# EAGLE design SAB Test Board rev 1 (EAGLE 9.6.2)

## Sheet 1 of 2
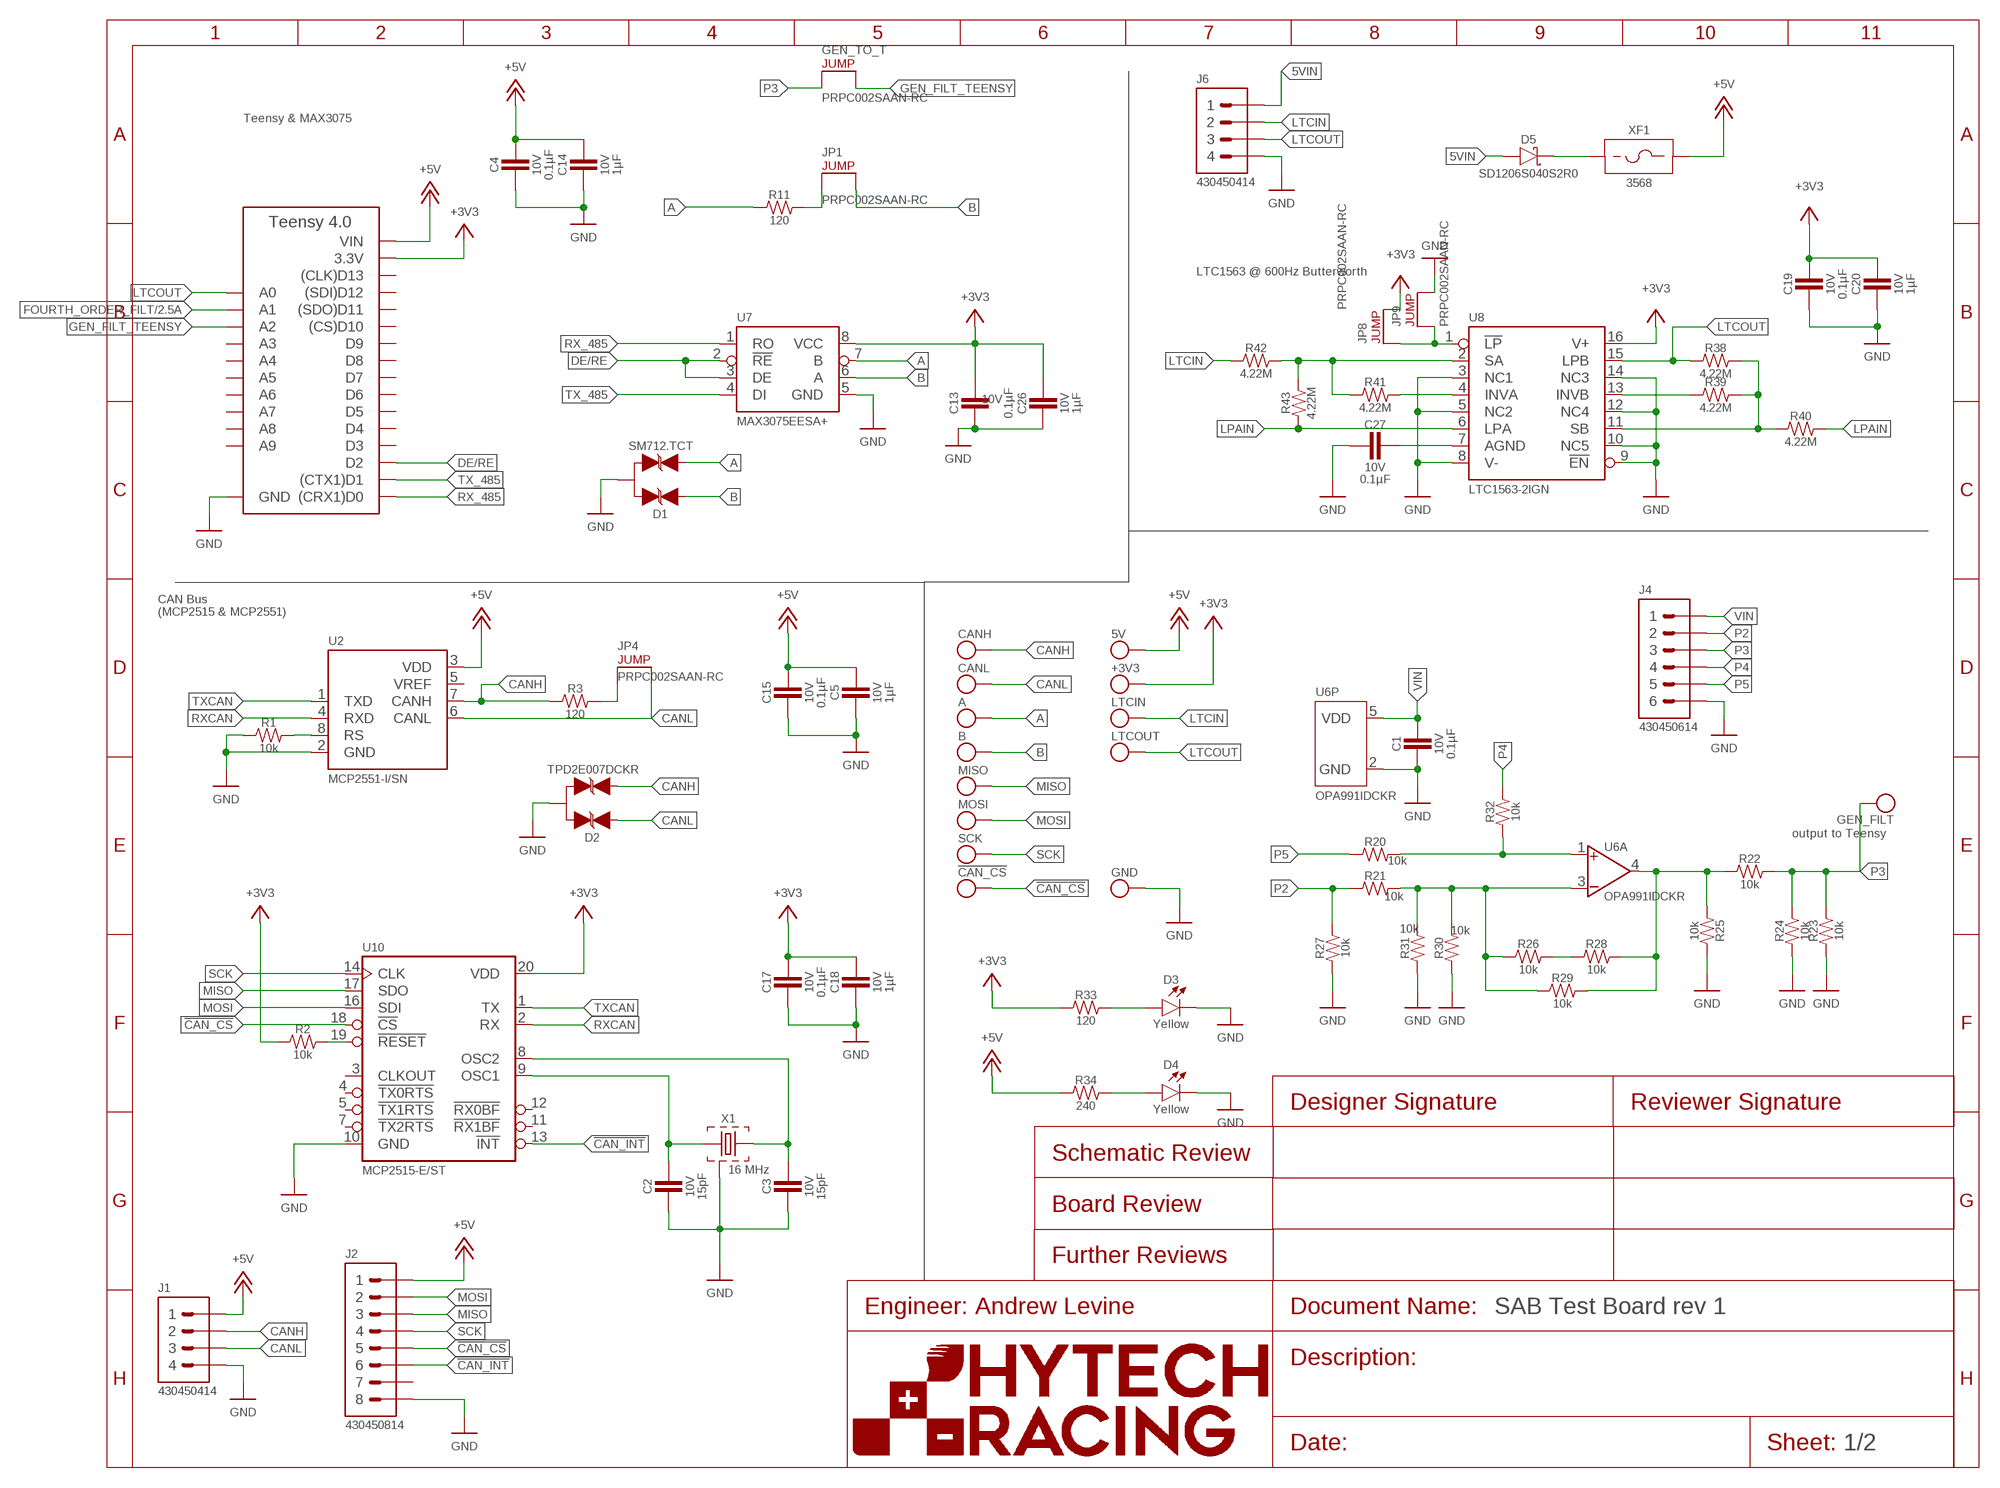
[diagram p0: schematic, sheet 1]

### Parts
5V  TEST_POINT  [5015]
!CAN_CS  TEST_POINT  [5015]
+3V3  TEST_POINT  [5015]
A  TEST_POINT  [5015]
A1  TEENSY_4.0TH  [TEENSY_SHORT]
B  TEST_POINT  [5015]
C1  CAPACITOR_0603_10V_0.1UF  [0603-CAP]
C2  CAPACITOR_0603_10V_15PF  [0603-CAP]
C3  CAPACITOR_0603_10V_15PF  [0603-CAP]
C4  CAPACITOR_0603_10V_0.1UF  [0603-CAP]
C5  CAPACITOR_0603_10V_1UF  [0603-CAP]
C13  CAPACITOR_0603_10V_0.1UF  [0603-CAP]
C14  CAPACITOR_0603_10V_1UF  [0603-CAP]
C15  CAPACITOR_0603_10V_0.1UF  [0603-CAP]
C17  CAPACITOR_0603_10V_0.1UF  [0603-CAP]
C18  CAPACITOR_0603_10V_1UF  [0603-CAP]
C19  CAPACITOR_0603_10V_0.1UF  [0603-CAP]
C20  CAPACITOR_0603_10V_1UF  [0603-CAP]
C26  CAPACITOR_0603_10V_1UF  [0603-CAP]
C27  CAPACITOR_0603_10V_0.1UF  [0603-CAP]
CANH  TEST_POINT  [5015]
CANL  TEST_POINT  [5015]
D1  TVS_BIDIRECTIONAL_DUALRS422  [SOT-23]
D2  TVS_BIDIRECTIONAL_DUAL  [SC-70-3]
D3  LED_0603_YELLOW  [0603-LED]
D4  LED_0603_YELLOW  [0603-LED]
D5  SCHOTTKY_1206_40V  [1206-DIODE]
GEN_FILT  TEST_POINT  [5015]
GEN_TO_T  JUMPER__1X02  [1X02]
GND  TEST_POINT  [5015]
J1  CONNECTOR-4_μF_T_V_BLACK  [MOLEX_MICROFIT_PTH_VERTICAL_04_DUAL]
J2  CONNECTOR-8_μF_T_V_BLACK  [MOLEX_MICROFIT_PTH_VERTICAL_08_DUAL]
J4  CONNECTOR-6_μF_T_V_BLACK  [MOLEX_MICROFIT_PTH_VERTICAL_06_DUAL]
J6  CONNECTOR-4_μF_T_V_BLACK  [MOLEX_MICROFIT_PTH_VERTICAL_04_DUAL]
JP1  JUMPER__1X02  [1X02]
JP4  JUMPER__1X02  [1X02]
JP8  JUMPER__1X02  [1X02]
JP9  JUMPER__1X02  [1X02]
LTCIN  TEST_POINT  [5015]
LTCOUT  TEST_POINT  [5015]
MISO  TEST_POINT  [5015]
MOSI  TEST_POINT  [5015]
R1  RESISTOR_0603_10K  [0603-RES]
R2  RESISTOR_0603_10K  [0603-RES]
R3  RESISTOR_0603_120  [0603-RES]
R11  RESISTOR_0603_120  [0603-RES]
R20  RESISTOR_0603_10K  [0603-RES]
R21  RESISTOR_0603_10K  [0603-RES]
R22  RESISTOR_0603_10K  [0603-RES]
R23  RESISTOR_0603_10K  [0603-RES]
R24  RESISTOR_0603_10K  [0603-RES]
R25  RESISTOR_0603_10K  [0603-RES]
R26  RESISTOR_0603_10K  [0603-RES]
R27  RESISTOR_0603_10K  [0603-RES]
R28  RESISTOR_0603_10K  [0603-RES]
R29  RESISTOR_0603_10K  [0603-RES]
R30  RESISTOR_0603_10K  [0603-RES]
R31  RESISTOR_0603_10K  [0603-RES]
R32  RESISTOR_0603_10K  [0603-RES]
R33  RESISTOR_0603_120  [0603-RES]
R34  RESISTOR_0603_240  [0603-RES]
R38  RESISTOR_0603_4.22M  [0603-RES]
R39  RESISTOR_0603_4.22M  [0603-RES]
R40  RESISTOR_0603_4.22M  [0603-RES]
R41  RESISTOR_0603_4.22M  [0603-RES]
R42  RESISTOR_0603_4.22M  [0603-RES]
R43  RESISTOR_0603_4.22M  [0603-RES]
SCK  TEST_POINT  [5015]
U2  MCP2551  [SOIC-08(NARROW,0.15")]
U6  OPAMP_1_CHANNEL_OPA991  [SC-70-5]
U7  MAX3075  [SOIC-08(NARROW,0.15")]
U8  LTC1563  [SSOP-16]
U10  MCP2515  [TSSOP-20]
X1  CRYSTAL_16MHZ  [ECX-42]
XF1  FUSE_HOLDER_MINIBLADEPTH  [3568]

### Nets
5VIN: D5.1(A) J6.1
!CAN_CS: !CAN_CS.1 J2.5 U10.18(!CS)
!CAN_INT: J2.6 U10.13(!INT)
+3V3: +3V3.1 A1.3.3V C13.1 C17.1 C18.1 C19.1 C20.1 C26.1 JP8.2 R2.1 R33.1 U7.8(VCC) U8.16(V+) U10.20(VDD) ; also sheet 2
+5V: 5V.1 A1.VIN C4.1 C5.1 C14.1 C15.1 J1.1 J2.1 R34.1 U2.3(VDD) XF1.3 XF1.4 ; also sheet 2
A: A.1 D1.2(C2) R11.1 U7.7(B)
B: B.1 D1.1(C1) JP1.2 U7.6(A)
CANH: CANH.1 D2.2(C2) J1.2 R3.1 U2.7(CANH)
CANL: CANL.1 D2.1(C1) J1.3 JP4.2 U2.6(CANL)
DE/RE: A1.D2 U7.2(!RE) U7.3(DE)
FOURTH_ORDER_FILT: A1.D15(A1) ; also sheet 2
GEN_FILT_TEENSY: A1.D16(A2) GEN_TO_T.2
GND: A1.AGND/GND(GND) A1.GND C1.2 C2.2 C3.2 C4.2 C5.2 C13.2 C14.2 C15.2 C17.2 C18.2 C19.2 C20.2 C26.2 C27.2 D1.3(A) D2.3(A) D3.1(C) D4.1(C) GND.1 J1.4 J2.8 J4.6 J6.4 JP9.2 R1.1 R23.1 R24.1 R25.2 R27.1 R30.1 R31.1 U2.2(GND) U6.2(P:GND) U7.5(GND) U8.3(NC1) U8.5(NC2) U8.8(V-) U8.9(!EN) U8.10(NC5) U8.12(NC4) U8.14(NC3) U10.10(GND) X1.2(GND) X1.4(GND) ; also sheet 2
LPAIN: R40.2 R43.1 U8.6(LPA)
LTCIN: J6.2 LTCIN.1 R42.1
LTCOUT: A1.D14(A0) J6.3 LTCOUT.1 R38.1 U8.15(LPB)
MISO: J2.3 MISO.1 U10.17(SDO)
MOSI: J2.2 MOSI.1 U10.16(SDI)
N$1: C2.1 U10.9(OSC1) X1.1
N$2: C3.1 U10.8(OSC2) X1.3
N$3: R1.2 U2.8(RS)
N$4: JP4.1 R3.2
N$5: R2.2 U10.19(!RESET)
N$6: D5.2(C) XF1.1 XF1.2
N$7: JP1.1 R11.2
N$9: R22.1 R25.1 R28.2 R29.2 U6.4(A:VOUT)
N$10: JP8.1 JP9.1 U8.1(!LP)
N$12: R20.2 R32.1 U6.1(A:VIN+)
N$23: D3.2(A) R33.2
N$25: D4.2(A) R34.2
N$27: R26.2 R28.1
N$28: R21.2 R26.1 R29.1 R30.2 R31.2 U6.3(A:VIN-)
N$29: C27.1 U8.7(AGND)
N$32: R39.1 U8.13(INVB)
N$33: R38.2 R39.2 R40.1 U8.11(SB)
N$34: R41.2 U8.4(INVA)
N$35: R41.1 R42.2 R43.2 U8.2(SA)
P2: J4.2 R21.1 R27.2
P3: GEN_FILT.1 GEN_TO_T.1 J4.3 R22.2 R23.2 R24.2
P4: J4.4 R32.2
P5: J4.5 R20.1
RX_485: A1.D0((CRX1)D0) U7.1(RO)
RXCAN: U2.4(RXD) U10.2(RX)
SCK: J2.4 SCK.1 U10.14(CLK)
TX_485: A1.D1((CTX1)D1) U7.4(DI)
TXCAN: U2.1(TXD) U10.1(TX)
VIN: C1.1 J4.1 U6.5(P:VDD)
Unconnected: A1.D3 A1.D4 A1.D5 A1.D6 A1.D7 A1.D8 A1.D9 A1.D10((CS)D10) A1.D11((SDO)D11) A1.D12((SDI)D12) A1.D13((CLK)D13) A1.D17(A3) A1.D18(A4) A1.D19(A5) A1.D20(A6) A1.D21(A7) A1.D22(A8) A1.D23(A9) J2.7 U10.3(CLKOUT) U10.4(!TX0RTS) U10.5(!TX1RTS) U10.7(!TX2RTS) U10.11(!RX1BF) U10.12(!RX0BF)

### Notes on the sheet
- Teensy & MAX3075
- LTC1563 @ 600Hz Butterworth
- CAN Bus
  (MCP2515 & MCP2551)
- output to Teensy
- Andrew Levine

## Sheet 2 of 2
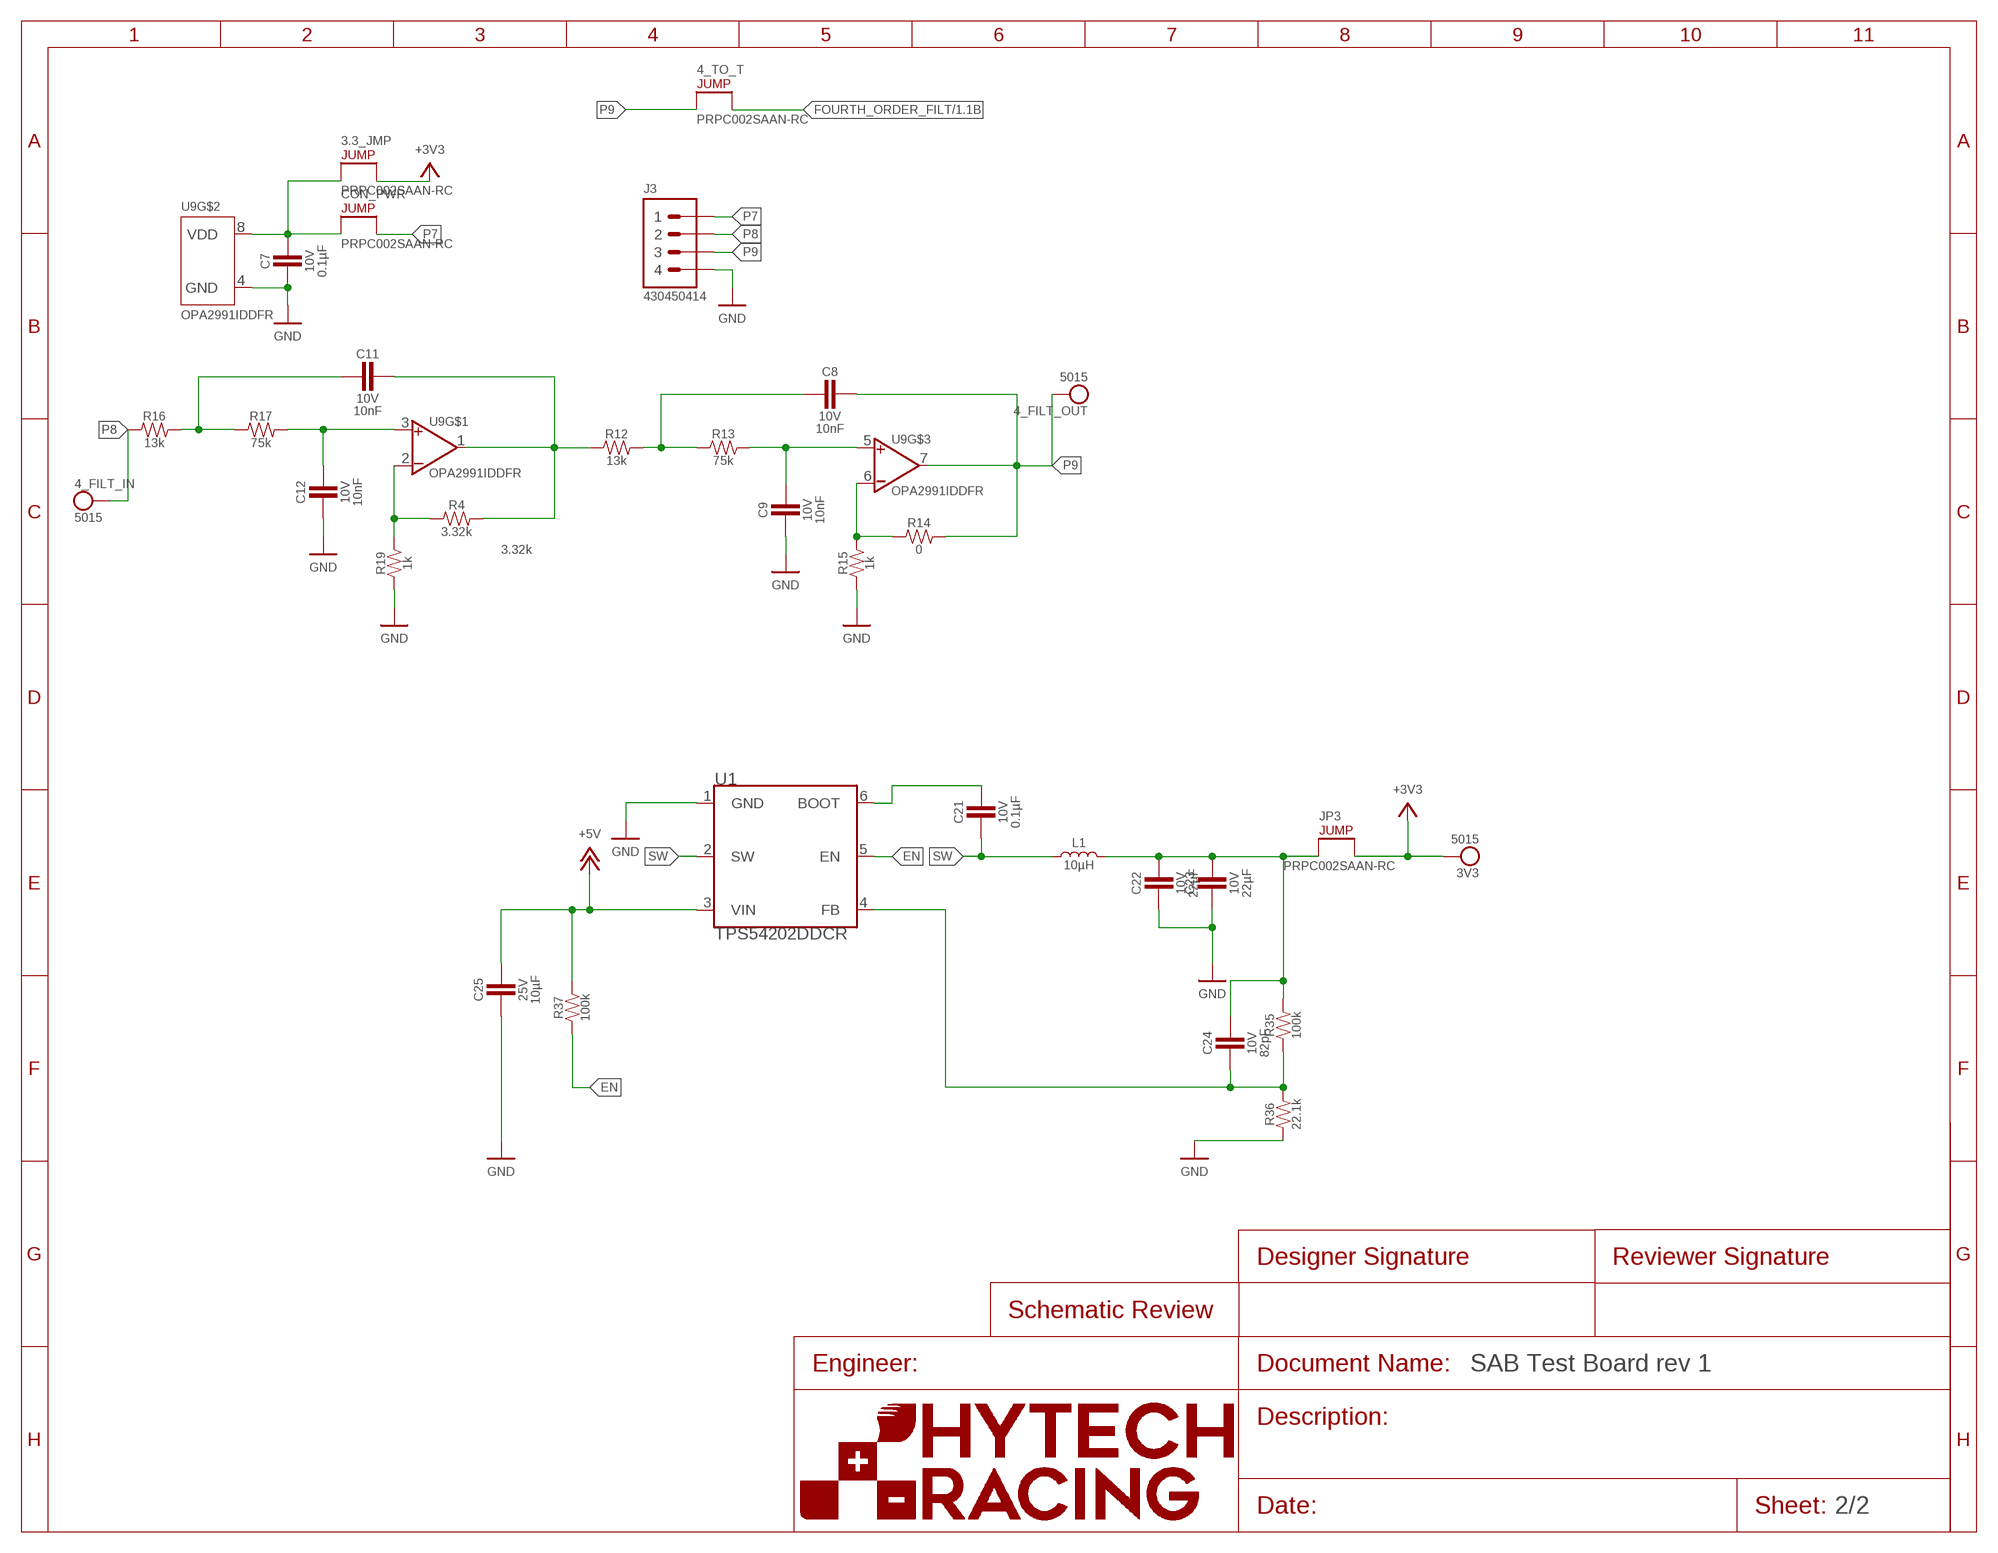
[diagram p1: schematic, sheet 2]

### Parts
3.3_JMP  JUMPER__1X02  [1X02]
3V3  TEST_POINT  [5015]
4_FILT_IN  TEST_POINT  [5015]
4_FILT_OUT  TEST_POINT  [5015]
4_TO_T  JUMPER__1X02  [1X02]
C7  CAPACITOR_0603_10V_0.1UF  [0603-CAP]
C8  CAPACITOR_0603_10V_10NF  [0603-CAP]
C9  CAPACITOR_0603_10V_10NF  [0603-CAP]
C11  CAPACITOR_0603_10V_10NF  [0603-CAP]
C12  CAPACITOR_0603_10V_10NF  [0603-CAP]
C21  CAPACITOR_0603_10V_0.1UF  [0603-CAP]
C22  CAPACITOR_0603_10V_22UF  [0603-CAP]
C23  CAPACITOR_0603_10V_22UF  [0603-CAP]
C24  CAPACITOR_0603_10V_82PF  [0603-CAP]
C25  CAPACITOR_0603_25V_10UF  [0603-CAP]
CON_PWR  JUMPER__1X02  [1X02]
J3  CONNECTOR-4_μF_T_V_BLACK  [MOLEX_MICROFIT_PTH_VERTICAL_04_DUAL]
JP3  JUMPER__1X02  [1X02]
L1  INDUCTOR_PA4334_10UH  [PA4334]
R4  RESISTOR_0603_3.32K  [0603-RES]
R12  RESISTOR_0603_13K  [0603-RES]
R13  RESISTOR_0603_75K  [0603-RES]
R14  RESISTOR_0603_0  [0603-RES]
R15  RESISTOR_0603_1K  [0603-RES]
R16  RESISTOR_0603_13K  [0603-RES]
R17  RESISTOR_0603_75K  [0603-RES]
R19  RESISTOR_0603_1K  [0603-RES]
R35  RESISTOR_0603_100K  [0603-RES]
R36  RESISTOR_0603_22.1K  [0603-RES]
R37  RESISTOR_0603_100K  [0603-RES]
U1  TPS54202DDCR  [SOT-23-6]
U9  OPAMP_2_CHANNEL_OPA_2991  [SOT-23-8]

### Nets
+3V3: 3.3_JMP.2 3V3.1 JP3.2 ; also sheet 1
+5V: C25.1 R37.2 U1.3(VIN) ; also sheet 1
EN: R37.1 U1.5(EN)
FOURTH_ORDER_FILT: 4_TO_T.2 ; also sheet 1
GND: C7.2 C9.2 C12.2 C22.2 C23.2 C25.2 J3.4 R15.1 R19.1 R36.1 U1.1(GND) U9.4(GND) ; also sheet 1
N$8: C9.1 R13.2 U9.5(VIN+)
N$11: C8.2 R12.2 R13.1
N$13: R14.1 R15.2 U9.6(VIN-)
N$18: C21.1 U1.6(BOOT)
N$19: C12.1 R17.2 U9.3(VIN+)
N$20: C11.2 R16.2 R17.1
N$21: C11.1 R4.2 R12.1 U9.1(VOUT)
N$22: R4.1 R19.2 U9.2(VIN-)
N$30: C24.2 R35.1 R36.2 U1.4(FB)
N$41: C22.1 C23.1 C24.1 JP3.1 L1.2 R35.2
N$42: 3.3_JMP.1 C7.1 CON_PWR.1 U9.8(VDD)
P7: CON_PWR.2 J3.1
P8: 4_FILT_IN.1 J3.2 R16.1
P9: 4_FILT_OUT.1 4_TO_T.1 C8.1 J3.3 R14.2 U9.7(VOUT)
SW: C21.2 L1.1 U1.2(SW)

### Notes on the sheet
- 3.32k

## Power pins joined to a net without a drawn wire
VREF: U2.5(VREF)

## Library data of the parts
3.3_JMP 4_TO_T CON_PWR GEN_TO_T JP1 JP3 JP4 JP8 JP9 = HyTechDevices:JUMPER_?_*: 2 Pin Connector; DKPN: S1011EC-02-ND; MANUFACTURER: Sullins Connector Solutions; MPN: PRPC002SAAN-RC
3V3 4_FILT_IN 4_FILT_OUT 5V !CAN_CS +3V3 A B CANH CANL GEN_FILT GND LTCIN LTCOUT MISO MOSI SCK = HyTechDevices:TEST_POINT: Test Point for Probing; DKPN: 36-5015CT-ND; MANUFACTURER: Keystone Electronics; MOPN: 534-5015; MPN: 5015
A1 = HyTechDevices:TEENSY_4.0: Teensy 4.0 Datasheet <https://www.pjrc.com/store/teensy40.html> Requires ordering of: 2: 14 pin, 0.1" pitch female headers. Recommend Samtec SSM-114-L-SV for surface mount variant.; TEENSY: 4.0
C1 C4 C7 C13 C15 C17 C19 C21 C27 = HyTechDevices:CAPACITOR_?_*: Capacitor, Non-Polarized VJ...1BC Series Datasheet <https://www.mouser.com/datasheet/2/427/vjw1bcbascomseries-1762447.pdf> Samsung Datasheet <https://www.mouser.com/datasheet/2/585/MLCC-1837944.pdf> Samsung Automotive MLCC Datasheet <https://www.mouser.com/datasheet/2/585/MLCC_Automotive-1837966.pdf> Walsin Datasheet <https://www.mouser.com/datasheet/2/210/WTC_MLCC_General_Purpose-1534899.pdf> GRM188R61A226ME15D <https://www.mouser.com/datasheet/2/281/1/GRM188R61A226ME15_02A-1985787.pdf> GRM188R61E106MA73D <https://www.mouser.com/datasheet/2/281/1/GRM188R61E106MA73_01A-1985806.pdf> 885012006013 <https://www.mouser.com/datasheet/2/445/885012006013-1726946.pdf> 2220Y6300105KXTWS2 <https://www.mouser.com/datasheet/2/218/SMD_High_and_Std_StackiCap_P62-1825512.pdf> Yageo Class 2, X5R <https://www.mouser.com/datasheet/2/447/UPY_GPHC_X5R_4V_to_50V_26-1827097.pdf> TDK C Series <https://www.mouser.com/ProductDetail/TDK/C3216X5R1V226M160AC?qs=%2Fha2pyFadujbcx9jh7lYl%2F4NeMoXFhdc8AqVWNq4wW6M2y7zl6GzBuhgtI0ngznN> AVX Automotive MLCC <https://www.mouser.com/datasheet/2/40/AutoMLCC-777028.pdf> KEMET X7R Series <https://www.mouser.com/datasheet/2/212/KEM_C1002_X7R_SMD-1102033.pdf> Kyocera AVX <https://www.mouser.com/datasheet/2/40/C0GNP0_Dielectric-951274.pdf> GRM21BR61H <https://www.mouser.com/datasheet/2/281/1/GRM21BR61H106KE43_01A-1986884.pdf> C1812W104KDRACTU <https://www.mouser.com/datasheet/2/212/KEM_C1034_X7R_HV_ARC_SMD-1101730.pdf> CGA series - MLCC Automotive grade <https://product.tdk.com/system/files/dam/doc/product/capacitor/ceramic/mlcc/catalog/mlcc_automotive_general_en.pdf>; CAPACITANCE: 0.1µF; DKPN: 720-1688-1-ND; MANUFACTURER: Vishay Vitramon; MOPN: 77-VJ0603Y104JXQPBC; MPN: VJ0603Y104JXQPW1BC; TOLERANCE: 5%; VOLTAGE: 10V
C2 C3 = HyTechDevices:CAPACITOR_?_*: Capacitor, Non-Polarized VJ...1BC Series Datasheet <https://www.mouser.com/datasheet/2/427/vjw1bcbascomseries-1762447.pdf> Samsung Datasheet <https://www.mouser.com/datasheet/2/585/MLCC-1837944.pdf> Samsung Automotive MLCC Datasheet <https://www.mouser.com/datasheet/2/585/MLCC_Automotive-1837966.pdf> Walsin Datasheet <https://www.mouser.com/datasheet/2/210/WTC_MLCC_General_Purpose-1534899.pdf> GRM188R61A226ME15D <https://www.mouser.com/datasheet/2/281/1/GRM188R61A226ME15_02A-1985787.pdf> GRM188R61E106MA73D <https://www.mouser.com/datasheet/2/281/1/GRM188R61E106MA73_01A-1985806.pdf> 885012006013 <https://www.mouser.com/datasheet/2/445/885012006013-1726946.pdf> 2220Y6300105KXTWS2 <https://www.mouser.com/datasheet/2/218/SMD_High_and_Std_StackiCap_P62-1825512.pdf> Yageo Class 2, X5R <https://www.mouser.com/datasheet/2/447/UPY_GPHC_X5R_4V_to_50V_26-1827097.pdf> TDK C Series <https://www.mouser.com/ProductDetail/TDK/C3216X5R1V226M160AC?qs=%2Fha2pyFadujbcx9jh7lYl%2F4NeMoXFhdc8AqVWNq4wW6M2y7zl6GzBuhgtI0ngznN> AVX Automotive MLCC <https://www.mouser.com/datasheet/2/40/AutoMLCC-777028.pdf> KEMET X7R Series <https://www.mouser.com/datasheet/2/212/KEM_C1002_X7R_SMD-1102033.pdf> Kyocera AVX <https://www.mouser.com/datasheet/2/40/C0GNP0_Dielectric-951274.pdf> GRM21BR61H <https://www.mouser.com/datasheet/2/281/1/GRM21BR61H106KE43_01A-1986884.pdf> C1812W104KDRACTU <https://www.mouser.com/datasheet/2/212/KEM_C1034_X7R_HV_ARC_SMD-1101730.pdf> CGA series - MLCC Automotive grade <https://product.tdk.com/system/files/dam/doc/product/capacitor/ceramic/mlcc/catalog/mlcc_automotive_general_en.pdf>; CAPACITANCE: 15pF; DKPN: 720-VJ0603A150FXQPW1BCCT-ND; MANUFACTURER: Vishay Vitramon; MOPN: 77-VJ0603A150FXQPBC; MPN: VJ0603A150FXQPW1BC; TOLERANCE: 1%; VOLTAGE: 10V
C5 C14 C18 C20 C26 = HyTechDevices:CAPACITOR_?_*: Capacitor, Non-Polarized VJ...1BC Series Datasheet <https://www.mouser.com/datasheet/2/427/vjw1bcbascomseries-1762447.pdf> Samsung Datasheet <https://www.mouser.com/datasheet/2/585/MLCC-1837944.pdf> Samsung Automotive MLCC Datasheet <https://www.mouser.com/datasheet/2/585/MLCC_Automotive-1837966.pdf> Walsin Datasheet <https://www.mouser.com/datasheet/2/210/WTC_MLCC_General_Purpose-1534899.pdf> GRM188R61A226ME15D <https://www.mouser.com/datasheet/2/281/1/GRM188R61A226ME15_02A-1985787.pdf> GRM188R61E106MA73D <https://www.mouser.com/datasheet/2/281/1/GRM188R61E106MA73_01A-1985806.pdf> 885012006013 <https://www.mouser.com/datasheet/2/445/885012006013-1726946.pdf> 2220Y6300105KXTWS2 <https://www.mouser.com/datasheet/2/218/SMD_High_and_Std_StackiCap_P62-1825512.pdf> Yageo Class 2, X5R <https://www.mouser.com/datasheet/2/447/UPY_GPHC_X5R_4V_to_50V_26-1827097.pdf> TDK C Series <https://www.mouser.com/ProductDetail/TDK/C3216X5R1V226M160AC?qs=%2Fha2pyFadujbcx9jh7lYl%2F4NeMoXFhdc8AqVWNq4wW6M2y7zl6GzBuhgtI0ngznN> AVX Automotive MLCC <https://www.mouser.com/datasheet/2/40/AutoMLCC-777028.pdf> KEMET X7R Series <https://www.mouser.com/datasheet/2/212/KEM_C1002_X7R_SMD-1102033.pdf> Kyocera AVX <https://www.mouser.com/datasheet/2/40/C0GNP0_Dielectric-951274.pdf> GRM21BR61H <https://www.mouser.com/datasheet/2/281/1/GRM21BR61H106KE43_01A-1986884.pdf> C1812W104KDRACTU <https://www.mouser.com/datasheet/2/212/KEM_C1034_X7R_HV_ARC_SMD-1101730.pdf> CGA series - MLCC Automotive grade <https://product.tdk.com/system/files/dam/doc/product/capacitor/ceramic/mlcc/catalog/mlcc_automotive_general_en.pdf>; CAPACITANCE: 1µF; DKPN: 311-1796-1-ND; MANUFACTURER: Yageo; MOPN: 603-CC603KRX7R6BB105; MPN: CC0603KRX7R6BB105; TOLERANCE: 10%; VOLTAGE: 10V
C8 C9 C11 C12 = HyTechDevices:CAPACITOR_?_*: Capacitor, Non-Polarized VJ...1BC Series Datasheet <https://www.mouser.com/datasheet/2/427/vjw1bcbascomseries-1762447.pdf> Samsung Datasheet <https://www.mouser.com/datasheet/2/585/MLCC-1837944.pdf> Samsung Automotive MLCC Datasheet <https://www.mouser.com/datasheet/2/585/MLCC_Automotive-1837966.pdf> Walsin Datasheet <https://www.mouser.com/datasheet/2/210/WTC_MLCC_General_Purpose-1534899.pdf> GRM188R61A226ME15D <https://www.mouser.com/datasheet/2/281/1/GRM188R61A226ME15_02A-1985787.pdf> GRM188R61E106MA73D <https://www.mouser.com/datasheet/2/281/1/GRM188R61E106MA73_01A-1985806.pdf> 885012006013 <https://www.mouser.com/datasheet/2/445/885012006013-1726946.pdf> 2220Y6300105KXTWS2 <https://www.mouser.com/datasheet/2/218/SMD_High_and_Std_StackiCap_P62-1825512.pdf> Yageo Class 2, X5R <https://www.mouser.com/datasheet/2/447/UPY_GPHC_X5R_4V_to_50V_26-1827097.pdf> TDK C Series <https://www.mouser.com/ProductDetail/TDK/C3216X5R1V226M160AC?qs=%2Fha2pyFadujbcx9jh7lYl%2F4NeMoXFhdc8AqVWNq4wW6M2y7zl6GzBuhgtI0ngznN> AVX Automotive MLCC <https://www.mouser.com/datasheet/2/40/AutoMLCC-777028.pdf> KEMET X7R Series <https://www.mouser.com/datasheet/2/212/KEM_C1002_X7R_SMD-1102033.pdf> Kyocera AVX <https://www.mouser.com/datasheet/2/40/C0GNP0_Dielectric-951274.pdf> GRM21BR61H <https://www.mouser.com/datasheet/2/281/1/GRM21BR61H106KE43_01A-1986884.pdf> C1812W104KDRACTU <https://www.mouser.com/datasheet/2/212/KEM_C1034_X7R_HV_ARC_SMD-1101730.pdf> CGA series - MLCC Automotive grade <https://product.tdk.com/system/files/dam/doc/product/capacitor/ceramic/mlcc/catalog/mlcc_automotive_general_en.pdf>; CAPACITANCE: 10nF; DKPN: 311-4054-1-ND; MANUFACTURER: Yageo; MOPN: 603-CC603KRX7R6BB103; MPN: CC0603KRX7R6BB103; TOLERANCE: 10%; VOLTAGE: 10V
C22 C23 = HyTechDevices:CAPACITOR_?_*: Capacitor, Non-Polarized VJ...1BC Series Datasheet <https://www.mouser.com/datasheet/2/427/vjw1bcbascomseries-1762447.pdf> Samsung Datasheet <https://www.mouser.com/datasheet/2/585/MLCC-1837944.pdf> Samsung Automotive MLCC Datasheet <https://www.mouser.com/datasheet/2/585/MLCC_Automotive-1837966.pdf> Walsin Datasheet <https://www.mouser.com/datasheet/2/210/WTC_MLCC_General_Purpose-1534899.pdf> GRM188R61A226ME15D <https://www.mouser.com/datasheet/2/281/1/GRM188R61A226ME15_02A-1985787.pdf> GRM188R61E106MA73D <https://www.mouser.com/datasheet/2/281/1/GRM188R61E106MA73_01A-1985806.pdf> 885012006013 <https://www.mouser.com/datasheet/2/445/885012006013-1726946.pdf> 2220Y6300105KXTWS2 <https://www.mouser.com/datasheet/2/218/SMD_High_and_Std_StackiCap_P62-1825512.pdf> Yageo Class 2, X5R <https://www.mouser.com/datasheet/2/447/UPY_GPHC_X5R_4V_to_50V_26-1827097.pdf> TDK C Series <https://www.mouser.com/ProductDetail/TDK/C3216X5R1V226M160AC?qs=%2Fha2pyFadujbcx9jh7lYl%2F4NeMoXFhdc8AqVWNq4wW6M2y7zl6GzBuhgtI0ngznN> AVX Automotive MLCC <https://www.mouser.com/datasheet/2/40/AutoMLCC-777028.pdf> KEMET X7R Series <https://www.mouser.com/datasheet/2/212/KEM_C1002_X7R_SMD-1102033.pdf> Kyocera AVX <https://www.mouser.com/datasheet/2/40/C0GNP0_Dielectric-951274.pdf> GRM21BR61H <https://www.mouser.com/datasheet/2/281/1/GRM21BR61H106KE43_01A-1986884.pdf> C1812W104KDRACTU <https://www.mouser.com/datasheet/2/212/KEM_C1034_X7R_HV_ARC_SMD-1101730.pdf> CGA series - MLCC Automotive grade <https://product.tdk.com/system/files/dam/doc/product/capacitor/ceramic/mlcc/catalog/mlcc_automotive_general_en.pdf>; CAPACITANCE: 22µF; DKPN: 490-10476-1-ND; MANUFACTURER: Murata Electronics; MOPN: 81-GRM188R61A226ME5D; MPN: GRM188R61A226ME15D; TOLERANCE: 20%; VOLTAGE: 10V
C24 = HyTechDevices:CAPACITOR_?_*: Capacitor, Non-Polarized VJ...1BC Series Datasheet <https://www.mouser.com/datasheet/2/427/vjw1bcbascomseries-1762447.pdf> Samsung Datasheet <https://www.mouser.com/datasheet/2/585/MLCC-1837944.pdf> Samsung Automotive MLCC Datasheet <https://www.mouser.com/datasheet/2/585/MLCC_Automotive-1837966.pdf> Walsin Datasheet <https://www.mouser.com/datasheet/2/210/WTC_MLCC_General_Purpose-1534899.pdf> GRM188R61A226ME15D <https://www.mouser.com/datasheet/2/281/1/GRM188R61A226ME15_02A-1985787.pdf> GRM188R61E106MA73D <https://www.mouser.com/datasheet/2/281/1/GRM188R61E106MA73_01A-1985806.pdf> 885012006013 <https://www.mouser.com/datasheet/2/445/885012006013-1726946.pdf> 2220Y6300105KXTWS2 <https://www.mouser.com/datasheet/2/218/SMD_High_and_Std_StackiCap_P62-1825512.pdf> Yageo Class 2, X5R <https://www.mouser.com/datasheet/2/447/UPY_GPHC_X5R_4V_to_50V_26-1827097.pdf> TDK C Series <https://www.mouser.com/ProductDetail/TDK/C3216X5R1V226M160AC?qs=%2Fha2pyFadujbcx9jh7lYl%2F4NeMoXFhdc8AqVWNq4wW6M2y7zl6GzBuhgtI0ngznN> AVX Automotive MLCC <https://www.mouser.com/datasheet/2/40/AutoMLCC-777028.pdf> KEMET X7R Series <https://www.mouser.com/datasheet/2/212/KEM_C1002_X7R_SMD-1102033.pdf> Kyocera AVX <https://www.mouser.com/datasheet/2/40/C0GNP0_Dielectric-951274.pdf> GRM21BR61H <https://www.mouser.com/datasheet/2/281/1/GRM21BR61H106KE43_01A-1986884.pdf> C1812W104KDRACTU <https://www.mouser.com/datasheet/2/212/KEM_C1034_X7R_HV_ARC_SMD-1101730.pdf> CGA series - MLCC Automotive grade <https://product.tdk.com/system/files/dam/doc/product/capacitor/ceramic/mlcc/catalog/mlcc_automotive_general_en.pdf>; CAPACITANCE: 82pF; DKPN: 478-1025-1-ND; MANUFACTURER: Kyocera AVX; MOPN: 581-0201ZA820JAT2A; MPN: 0201ZA820JAT2A; TOLERANCE: 5%; VOLTAGE: 10V
C25 = HyTechDevices:CAPACITOR_?_*: Capacitor, Non-Polarized VJ...1BC Series Datasheet <https://www.mouser.com/datasheet/2/427/vjw1bcbascomseries-1762447.pdf> Samsung Datasheet <https://www.mouser.com/datasheet/2/585/MLCC-1837944.pdf> Samsung Automotive MLCC Datasheet <https://www.mouser.com/datasheet/2/585/MLCC_Automotive-1837966.pdf> Walsin Datasheet <https://www.mouser.com/datasheet/2/210/WTC_MLCC_General_Purpose-1534899.pdf> GRM188R61A226ME15D <https://www.mouser.com/datasheet/2/281/1/GRM188R61A226ME15_02A-1985787.pdf> GRM188R61E106MA73D <https://www.mouser.com/datasheet/2/281/1/GRM188R61E106MA73_01A-1985806.pdf> 885012006013 <https://www.mouser.com/datasheet/2/445/885012006013-1726946.pdf> 2220Y6300105KXTWS2 <https://www.mouser.com/datasheet/2/218/SMD_High_and_Std_StackiCap_P62-1825512.pdf> Yageo Class 2, X5R <https://www.mouser.com/datasheet/2/447/UPY_GPHC_X5R_4V_to_50V_26-1827097.pdf> TDK C Series <https://www.mouser.com/ProductDetail/TDK/C3216X5R1V226M160AC?qs=%2Fha2pyFadujbcx9jh7lYl%2F4NeMoXFhdc8AqVWNq4wW6M2y7zl6GzBuhgtI0ngznN> AVX Automotive MLCC <https://www.mouser.com/datasheet/2/40/AutoMLCC-777028.pdf> KEMET X7R Series <https://www.mouser.com/datasheet/2/212/KEM_C1002_X7R_SMD-1102033.pdf> Kyocera AVX <https://www.mouser.com/datasheet/2/40/C0GNP0_Dielectric-951274.pdf> GRM21BR61H <https://www.mouser.com/datasheet/2/281/1/GRM21BR61H106KE43_01A-1986884.pdf> C1812W104KDRACTU <https://www.mouser.com/datasheet/2/212/KEM_C1034_X7R_HV_ARC_SMD-1101730.pdf> CGA series - MLCC Automotive grade <https://product.tdk.com/system/files/dam/doc/product/capacitor/ceramic/mlcc/catalog/mlcc_automotive_general_en.pdf>; CAPACITANCE: 10µF; DKPN: 490-7202-1-ND; MANUFACTURER: Murata Electronics; MOPN: 81-GRM188R61E106MA3D; MPN: GRM188R61E106MA73D; TOLERANCE: 20%; VOLTAGE: 25V
D1 = HyTechDevices:TVS_BIDIRECTIONAL_DUAL: Bdirectional TVS for CAN ESD Datasheet <https://www.ti.com/lit/ds/symlink/tpd2e007.pdf?HQS=dis-mous-null-mousermode-dsf-pf-null-wwe&ts=1615155679700&ref_url=https%253A%252F%252Fwww.mouser.com%252F> SM712 Bidirectional TVS Diode -7V to 12V RSV Used for RS485 transreceiver chips (Works for RS422 since ADM4854ARZ runs both) Datasheet <https://semtech.my.salesforce.com/sfc/p/#E0000000JelG/a/440000001MKW/f6pBKheIN2CeR0DxWdS3THuJ7nh4aKYltSzghsLP5iw>; DKPN: SM712CT-ND; MANUFACTURER: Semtech Corporation; MOPN: 947-SM712.TCT; MPN: SM712.TCT
D2 = HyTechDevices:TVS_BIDIRECTIONAL_DUAL: Bdirectional TVS for CAN ESD Datasheet <https://www.ti.com/lit/ds/symlink/tpd2e007.pdf?HQS=dis-mous-null-mousermode-dsf-pf-null-wwe&ts=1615155679700&ref_url=https%253A%252F%252Fwww.mouser.com%252F> SM712 Bidirectional TVS Diode -7V to 12V RSV Used for RS485 transreceiver chips (Works for RS422 since ADM4854ARZ runs both) Datasheet <https://semtech.my.salesforce.com/sfc/p/#E0000000JelG/a/440000001MKW/f6pBKheIN2CeR0DxWdS3THuJ7nh4aKYltSzghsLP5iw>; DKPN: 296-25281-1-ND; MANUFACTURER: Texas Instruments; MOPN: 595-TPD2E007DCKR; MPN: TPD2E007DCKR
D3 D4 = HyTechDevices:LED_?_*: LED 0603 Blue <https://www.mouser.com/datasheet/2/216/APT1608VBC_D-246010.pdf> Green <https://www.mouser.com/datasheet/2/216/APT1608ZGCK-1173388.pdf> Orange <https://www.mouser.com/datasheet/2/216/APT1608SECK-6197.pdf> Red <https://www.mouser.com/datasheet/2/216/APT1608SECK-J3-PRV-1173336.pdf> White <https://www.mouser.com/datasheet/2/50/SM0603UWC-880813.pdf> Yellow <https://www.mouser.com/datasheet/2/216/APT1608SYCK-J3-PRV-1173311.pdf> 2835 (Series not on Digikey) Lumiled LUXEON 2835 Color Line <https://www.mouser.com/datasheet/2/602/DS236_luxeon_2835_color_line_datasheet-1596094.pdf>; COLOR: Yellow; DKPN: 754-1788-1-ND; MANUFACTURER: Kingbright; MOPN: 604-APT1608SYCK/J3-PRV; MPN: APT1608SYCK/J3-PRV
D5 = HyTechDevices:SCHOTTKY_?_*: CUS08F30 Shottky Diode Datasheet <https://www.mouser.com/datasheet/2/408/CUS08F30_datasheet_en_20140414-1916097.pdf> CMDSH2-3 Shottky Diode Datasheet <https://www.mouser.com/datasheet/2/68/cmdsh2-3-39086.pdf> SD1206S040S2R0 Schottky Diode Datasheet <https://datasheets.kyocera-avx.com/schottky.pdf>; DKPN: 478-7806-1-ND; MANUFACTURER: KYOCERA AVX; MOPN: 581-SD1206S040S2R0; MPN: SD1206S040S2R0; VOLTAGE: 40 V
J1 J3 J6 = HyTechDevices:CONNECTOR-4_?_*: 4 Pin Connector; DKPN: 2266-43045-0414-ND; MANUFACTURER: Molex; MOPN: 538-43045-0414; MPN: 430450414
J2 = HyTechDevices:CONNECTOR-8_?_*: 8 Pin Connector; DKPN: WM1798-ND; MANUFACTURER: Molex; MOPN: 538-43045-0814; MPN: 430450814
J4 = HyTechDevices:CONNECTOR-6_?_*: 6 Pin Connector; DKPN: WM1797-ND; MANUFACTURER: Molex; MOPN: 538-43045-0614; MPN: 430450614
L1 = HyTechDevices:INDUCTOR_?_*: Inductor LQM18DH100M70 Datasheet <https://search.murata.co.jp/Ceramy/image/img/P02/JELF243B-9127.pdf> 74451133 Datasheet <https://www.we-online.com/catalog/datasheet/74451133.pdf> SRU1408 Datasheet <https://www.mouser.com/datasheet/2/54/SRU1048-1391431.pdf> PA4334 Datasheet <https://www.mouser.com/datasheet/2/336/plei_s_a0002827602_1-2281222.pdf> WE-LMHI Datasheet <https://www.mouser.com/datasheet/2/445/74437349560-1721693.pdf> SRR0745A Datasheet <https://www.bourns.com/docs/Product-Datasheets/SRR0745A.pdf>; CURRENT_RATED: 300mA; CURRENT_SATURATION: 100mA; DCR: 1.37Ω; DKPN: 490-LQM18DH100M70LTR-ND; INDUCTANCE: 10µH; MANUFACTURER: Murata Electronics; MOPN: 81-LQM18DH100M70L; MPN: LQM18DH100M70L; TOLERANCE: 20%
R1 R2 R20-R32 = HyTechDevices:RESISTOR_?_*: Resistor PWR163 Series <https://www.mouser.com/datasheet/2/54/pwr163-777985.pdf> AC Series <https://www.mouser.com/datasheet/2/447/Yageo_PYu_AC_51_RoHS_L_7_1714230-1874691.pdf> PU Series <https://www.mouser.com/datasheet/2/447/PYu-PU_51_RoHS_L_6-1504619.pdf> UCR Series <https://fscdn.rohm.com/en/products/databook/datasheet/passive/resistor/chip_resistor/ucr-e.pdf> ERA Series <https://www.mouser.com/datasheet/2/315/AOA0000C307-1149632.pdf> PWR263 Series <https://www.mouser.com/datasheet/2/54/pwr263s_35-778069.pdf> KTR Series <https://www.mouser.com/datasheet/2/348/ROHM_S_A0011075115_1-2563276.pdf> RC Series <https://www.mouser.com/datasheet/2/447/Yageo_03_18_2021_PYu_RC_Group_51_RoHS_L_11-2199992.pdf> ERJ Low Resistance Series <https://www.mouser.com/datasheet/2/315/AOA0000C313-1141758.pdf> ERJ PB3, PB6 Series <https://www.mouser.com/datasheet/2/315/AOA0000C328-1530132.pdf> ERJ PA2, P03, PA3, P06, P08, P14 Series <https://www.mouser.com/datasheet/2/315/AOA0000C331-1141874.pdf> B20 Series <https://www.ohmite.com/assets/docs/res_200.pdf?r=false> TE Connectivity/Holsworthy RN73 Series <https://www.mouser.com/datasheet/2/418/4/NG_DS_1773270_M-604713.pdf> Vishay Dale D/CRCW e3 <https://www.mouser.com/datasheet/2/427/dcrcwe3-1762152.pdf> Ohmite B20 <https://www.ohmite.com/assets/docs/res_200.pdf?r=false>; DKPN: P10KBDCT-ND; MANUFACTURER: Panasonic Electronic Components; MOPN: 667-ERA-3ARB103V; MPN: ERA-3ARB103V; POWER: 0.1W; RESISTANCE: 10k; TOLERANCE: 0.1%; VOLTAGE_CONTINUOUS: 31.62V; VOLTAGE_MAX: 75V
R3 R11 R33 = HyTechDevices:RESISTOR_?_*: Resistor PWR163 Series <https://www.mouser.com/datasheet/2/54/pwr163-777985.pdf> AC Series <https://www.mouser.com/datasheet/2/447/Yageo_PYu_AC_51_RoHS_L_7_1714230-1874691.pdf> PU Series <https://www.mouser.com/datasheet/2/447/PYu-PU_51_RoHS_L_6-1504619.pdf> UCR Series <https://fscdn.rohm.com/en/products/databook/datasheet/passive/resistor/chip_resistor/ucr-e.pdf> ERA Series <https://www.mouser.com/datasheet/2/315/AOA0000C307-1149632.pdf> PWR263 Series <https://www.mouser.com/datasheet/2/54/pwr263s_35-778069.pdf> KTR Series <https://www.mouser.com/datasheet/2/348/ROHM_S_A0011075115_1-2563276.pdf> RC Series <https://www.mouser.com/datasheet/2/447/Yageo_03_18_2021_PYu_RC_Group_51_RoHS_L_11-2199992.pdf> ERJ Low Resistance Series <https://www.mouser.com/datasheet/2/315/AOA0000C313-1141758.pdf> ERJ PB3, PB6 Series <https://www.mouser.com/datasheet/2/315/AOA0000C328-1530132.pdf> ERJ PA2, P03, PA3, P06, P08, P14 Series <https://www.mouser.com/datasheet/2/315/AOA0000C331-1141874.pdf> B20 Series <https://www.ohmite.com/assets/docs/res_200.pdf?r=false> TE Connectivity/Holsworthy RN73 Series <https://www.mouser.com/datasheet/2/418/4/NG_DS_1773270_M-604713.pdf> Vishay Dale D/CRCW e3 <https://www.mouser.com/datasheet/2/427/dcrcwe3-1762152.pdf> Ohmite B20 <https://www.ohmite.com/assets/docs/res_200.pdf?r=false>; DKPN: P120DBCT-ND; MANUFACTURER: Panasonic Electronic Components; MOPN: 667-ERA-3AEB121V; MPN: ERA-3AEB121V; POWER: 0.1W; RESISTANCE: 120; TOLERANCE: 0.1%; VOLTAGE_CONTINUOUS: 3.46V; VOLTAGE_MAX: 75V
R4 = HyTechDevices:RESISTOR_?_*: Resistor PWR163 Series <https://www.mouser.com/datasheet/2/54/pwr163-777985.pdf> AC Series <https://www.mouser.com/datasheet/2/447/Yageo_PYu_AC_51_RoHS_L_7_1714230-1874691.pdf> PU Series <https://www.mouser.com/datasheet/2/447/PYu-PU_51_RoHS_L_6-1504619.pdf> UCR Series <https://fscdn.rohm.com/en/products/databook/datasheet/passive/resistor/chip_resistor/ucr-e.pdf> ERA Series <https://www.mouser.com/datasheet/2/315/AOA0000C307-1149632.pdf> PWR263 Series <https://www.mouser.com/datasheet/2/54/pwr263s_35-778069.pdf> KTR Series <https://www.mouser.com/datasheet/2/348/ROHM_S_A0011075115_1-2563276.pdf> RC Series <https://www.mouser.com/datasheet/2/447/Yageo_03_18_2021_PYu_RC_Group_51_RoHS_L_11-2199992.pdf> ERJ Low Resistance Series <https://www.mouser.com/datasheet/2/315/AOA0000C313-1141758.pdf> ERJ PB3, PB6 Series <https://www.mouser.com/datasheet/2/315/AOA0000C328-1530132.pdf> ERJ PA2, P03, PA3, P06, P08, P14 Series <https://www.mouser.com/datasheet/2/315/AOA0000C331-1141874.pdf> B20 Series <https://www.ohmite.com/assets/docs/res_200.pdf?r=false> TE Connectivity/Holsworthy RN73 Series <https://www.mouser.com/datasheet/2/418/4/NG_DS_1773270_M-604713.pdf> Vishay Dale D/CRCW e3 <https://www.mouser.com/datasheet/2/427/dcrcwe3-1762152.pdf> Ohmite B20 <https://www.ohmite.com/assets/docs/res_200.pdf?r=false>; DKPN: YAG1651TR-ND; MANUFACTURER: Yageo; MOPN: 603-RT0603BRD073K32L; MPN: RT0603BRD073K32L; POWER: 0.1W; RESISTANCE: 3.32k; TOLERANCE: 0.1%; VOLTAGE_CONTINUOUS: 18.22V; VOLTAGE_MAX: 75V
R12 R16 = HyTechDevices:RESISTOR_?_*: Resistor PWR163 Series <https://www.mouser.com/datasheet/2/54/pwr163-777985.pdf> AC Series <https://www.mouser.com/datasheet/2/447/Yageo_PYu_AC_51_RoHS_L_7_1714230-1874691.pdf> PU Series <https://www.mouser.com/datasheet/2/447/PYu-PU_51_RoHS_L_6-1504619.pdf> UCR Series <https://fscdn.rohm.com/en/products/databook/datasheet/passive/resistor/chip_resistor/ucr-e.pdf> ERA Series <https://www.mouser.com/datasheet/2/315/AOA0000C307-1149632.pdf> PWR263 Series <https://www.mouser.com/datasheet/2/54/pwr263s_35-778069.pdf> KTR Series <https://www.mouser.com/datasheet/2/348/ROHM_S_A0011075115_1-2563276.pdf> RC Series <https://www.mouser.com/datasheet/2/447/Yageo_03_18_2021_PYu_RC_Group_51_RoHS_L_11-2199992.pdf> ERJ Low Resistance Series <https://www.mouser.com/datasheet/2/315/AOA0000C313-1141758.pdf> ERJ PB3, PB6 Series <https://www.mouser.com/datasheet/2/315/AOA0000C328-1530132.pdf> ERJ PA2, P03, PA3, P06, P08, P14 Series <https://www.mouser.com/datasheet/2/315/AOA0000C331-1141874.pdf> B20 Series <https://www.ohmite.com/assets/docs/res_200.pdf?r=false> TE Connectivity/Holsworthy RN73 Series <https://www.mouser.com/datasheet/2/418/4/NG_DS_1773270_M-604713.pdf> Vishay Dale D/CRCW e3 <https://www.mouser.com/datasheet/2/427/dcrcwe3-1762152.pdf> Ohmite B20 <https://www.ohmite.com/assets/docs/res_200.pdf?r=false>; DKPN: P13KBECT-ND; MANUFACTURER: Panasonic Electronic Components; MOPN: 667-ERA-3ARW133V; MPN: ERA-3ARW133V; POWER: 0.1W; RESISTANCE: 13k; TOLERANCE: 0.05%; VOLTAGE_CONTINUOUS: 75V; VOLTAGE_MAX: 150V
R13 R17 = HyTechDevices:RESISTOR_?_*: Resistor PWR163 Series <https://www.mouser.com/datasheet/2/54/pwr163-777985.pdf> AC Series <https://www.mouser.com/datasheet/2/447/Yageo_PYu_AC_51_RoHS_L_7_1714230-1874691.pdf> PU Series <https://www.mouser.com/datasheet/2/447/PYu-PU_51_RoHS_L_6-1504619.pdf> UCR Series <https://fscdn.rohm.com/en/products/databook/datasheet/passive/resistor/chip_resistor/ucr-e.pdf> ERA Series <https://www.mouser.com/datasheet/2/315/AOA0000C307-1149632.pdf> PWR263 Series <https://www.mouser.com/datasheet/2/54/pwr263s_35-778069.pdf> KTR Series <https://www.mouser.com/datasheet/2/348/ROHM_S_A0011075115_1-2563276.pdf> RC Series <https://www.mouser.com/datasheet/2/447/Yageo_03_18_2021_PYu_RC_Group_51_RoHS_L_11-2199992.pdf> ERJ Low Resistance Series <https://www.mouser.com/datasheet/2/315/AOA0000C313-1141758.pdf> ERJ PB3, PB6 Series <https://www.mouser.com/datasheet/2/315/AOA0000C328-1530132.pdf> ERJ PA2, P03, PA3, P06, P08, P14 Series <https://www.mouser.com/datasheet/2/315/AOA0000C331-1141874.pdf> B20 Series <https://www.ohmite.com/assets/docs/res_200.pdf?r=false> TE Connectivity/Holsworthy RN73 Series <https://www.mouser.com/datasheet/2/418/4/NG_DS_1773270_M-604713.pdf> Vishay Dale D/CRCW e3 <https://www.mouser.com/datasheet/2/427/dcrcwe3-1762152.pdf> Ohmite B20 <https://www.ohmite.com/assets/docs/res_200.pdf?r=false>; DKPN: RT0603BRE0775KL-ND; MANUFACTURER: Yageo; MOPN: 603-RT0603BRE0775KL; MPN: RT0603BRE0775KL; POWER: 0.1W; RESISTANCE: 75k; TOLERANCE: 0.1%; VOLTAGE_CONTINUOUS: 75V; VOLTAGE_MAX: 75V
R14 = HyTechDevices:RESISTOR_?_*: Resistor PWR163 Series <https://www.mouser.com/datasheet/2/54/pwr163-777985.pdf> AC Series <https://www.mouser.com/datasheet/2/447/Yageo_PYu_AC_51_RoHS_L_7_1714230-1874691.pdf> PU Series <https://www.mouser.com/datasheet/2/447/PYu-PU_51_RoHS_L_6-1504619.pdf> UCR Series <https://fscdn.rohm.com/en/products/databook/datasheet/passive/resistor/chip_resistor/ucr-e.pdf> ERA Series <https://www.mouser.com/datasheet/2/315/AOA0000C307-1149632.pdf> PWR263 Series <https://www.mouser.com/datasheet/2/54/pwr263s_35-778069.pdf> KTR Series <https://www.mouser.com/datasheet/2/348/ROHM_S_A0011075115_1-2563276.pdf> RC Series <https://www.mouser.com/datasheet/2/447/Yageo_03_18_2021_PYu_RC_Group_51_RoHS_L_11-2199992.pdf> ERJ Low Resistance Series <https://www.mouser.com/datasheet/2/315/AOA0000C313-1141758.pdf> ERJ PB3, PB6 Series <https://www.mouser.com/datasheet/2/315/AOA0000C328-1530132.pdf> ERJ PA2, P03, PA3, P06, P08, P14 Series <https://www.mouser.com/datasheet/2/315/AOA0000C331-1141874.pdf> B20 Series <https://www.ohmite.com/assets/docs/res_200.pdf?r=false> TE Connectivity/Holsworthy RN73 Series <https://www.mouser.com/datasheet/2/418/4/NG_DS_1773270_M-604713.pdf> Vishay Dale D/CRCW e3 <https://www.mouser.com/datasheet/2/427/dcrcwe3-1762152.pdf> Ohmite B20 <https://www.ohmite.com/assets/docs/res_200.pdf?r=false>; DKPN: 311-0.0HRCT-ND; MANUFACTURER: Yageo; MOPN: 603-RC0603FR-070RL; MPN: RC0603FR-070RL; POWER: 0.1W; RESISTANCE: 0; TOLERANCE: 1%; VOLTAGE_CONTINUOUS: 75V; VOLTAGE_MAX: 75V
R15 R19 = HyTechDevices:RESISTOR_?_*: Resistor PWR163 Series <https://www.mouser.com/datasheet/2/54/pwr163-777985.pdf> AC Series <https://www.mouser.com/datasheet/2/447/Yageo_PYu_AC_51_RoHS_L_7_1714230-1874691.pdf> PU Series <https://www.mouser.com/datasheet/2/447/PYu-PU_51_RoHS_L_6-1504619.pdf> UCR Series <https://fscdn.rohm.com/en/products/databook/datasheet/passive/resistor/chip_resistor/ucr-e.pdf> ERA Series <https://www.mouser.com/datasheet/2/315/AOA0000C307-1149632.pdf> PWR263 Series <https://www.mouser.com/datasheet/2/54/pwr263s_35-778069.pdf> KTR Series <https://www.mouser.com/datasheet/2/348/ROHM_S_A0011075115_1-2563276.pdf> RC Series <https://www.mouser.com/datasheet/2/447/Yageo_03_18_2021_PYu_RC_Group_51_RoHS_L_11-2199992.pdf> ERJ Low Resistance Series <https://www.mouser.com/datasheet/2/315/AOA0000C313-1141758.pdf> ERJ PB3, PB6 Series <https://www.mouser.com/datasheet/2/315/AOA0000C328-1530132.pdf> ERJ PA2, P03, PA3, P06, P08, P14 Series <https://www.mouser.com/datasheet/2/315/AOA0000C331-1141874.pdf> B20 Series <https://www.ohmite.com/assets/docs/res_200.pdf?r=false> TE Connectivity/Holsworthy RN73 Series <https://www.mouser.com/datasheet/2/418/4/NG_DS_1773270_M-604713.pdf> Vishay Dale D/CRCW e3 <https://www.mouser.com/datasheet/2/427/dcrcwe3-1762152.pdf> Ohmite B20 <https://www.ohmite.com/assets/docs/res_200.pdf?r=false>; DKPN: 1712-CPF-A-0603B1K0ETR-ND; MANUFACTURER: TE Connectivity Passive Product; MOPN: 279-CPF-A-0603B1K0E; MPN: CPF-A-0603B1K0E; POWER: 0.0625W; RESISTANCE: 1k; TOLERANCE: 0.1%; VOLTAGE_CONTINUOUS: 7.9V; VOLTAGE_MAX: 50V
R34 = HyTechDevices:RESISTOR_?_*: Resistor PWR163 Series <https://www.mouser.com/datasheet/2/54/pwr163-777985.pdf> AC Series <https://www.mouser.com/datasheet/2/447/Yageo_PYu_AC_51_RoHS_L_7_1714230-1874691.pdf> PU Series <https://www.mouser.com/datasheet/2/447/PYu-PU_51_RoHS_L_6-1504619.pdf> UCR Series <https://fscdn.rohm.com/en/products/databook/datasheet/passive/resistor/chip_resistor/ucr-e.pdf> ERA Series <https://www.mouser.com/datasheet/2/315/AOA0000C307-1149632.pdf> PWR263 Series <https://www.mouser.com/datasheet/2/54/pwr263s_35-778069.pdf> KTR Series <https://www.mouser.com/datasheet/2/348/ROHM_S_A0011075115_1-2563276.pdf> RC Series <https://www.mouser.com/datasheet/2/447/Yageo_03_18_2021_PYu_RC_Group_51_RoHS_L_11-2199992.pdf> ERJ Low Resistance Series <https://www.mouser.com/datasheet/2/315/AOA0000C313-1141758.pdf> ERJ PB3, PB6 Series <https://www.mouser.com/datasheet/2/315/AOA0000C328-1530132.pdf> ERJ PA2, P03, PA3, P06, P08, P14 Series <https://www.mouser.com/datasheet/2/315/AOA0000C331-1141874.pdf> B20 Series <https://www.ohmite.com/assets/docs/res_200.pdf?r=false> TE Connectivity/Holsworthy RN73 Series <https://www.mouser.com/datasheet/2/418/4/NG_DS_1773270_M-604713.pdf> Vishay Dale D/CRCW e3 <https://www.mouser.com/datasheet/2/427/dcrcwe3-1762152.pdf> Ohmite B20 <https://www.ohmite.com/assets/docs/res_200.pdf?r=false>; DKPN: 311-240HRCT-ND; MANUFACTURER: Yageo; MOPN: 603-RC0603FR-07240RL; MPN: RC0603FR-07240RL; POWER: 0.1W; RESISTANCE: 240; TOLERANCE: 1%; VOLTAGE_CONTINUOUS: 4.90V; VOLTAGE_MAX: 75V
R35 R37 = HyTechDevices:RESISTOR_?_*: Resistor PWR163 Series <https://www.mouser.com/datasheet/2/54/pwr163-777985.pdf> AC Series <https://www.mouser.com/datasheet/2/447/Yageo_PYu_AC_51_RoHS_L_7_1714230-1874691.pdf> PU Series <https://www.mouser.com/datasheet/2/447/PYu-PU_51_RoHS_L_6-1504619.pdf> UCR Series <https://fscdn.rohm.com/en/products/databook/datasheet/passive/resistor/chip_resistor/ucr-e.pdf> ERA Series <https://www.mouser.com/datasheet/2/315/AOA0000C307-1149632.pdf> PWR263 Series <https://www.mouser.com/datasheet/2/54/pwr263s_35-778069.pdf> KTR Series <https://www.mouser.com/datasheet/2/348/ROHM_S_A0011075115_1-2563276.pdf> RC Series <https://www.mouser.com/datasheet/2/447/Yageo_03_18_2021_PYu_RC_Group_51_RoHS_L_11-2199992.pdf> ERJ Low Resistance Series <https://www.mouser.com/datasheet/2/315/AOA0000C313-1141758.pdf> ERJ PB3, PB6 Series <https://www.mouser.com/datasheet/2/315/AOA0000C328-1530132.pdf> ERJ PA2, P03, PA3, P06, P08, P14 Series <https://www.mouser.com/datasheet/2/315/AOA0000C331-1141874.pdf> B20 Series <https://www.ohmite.com/assets/docs/res_200.pdf?r=false> TE Connectivity/Holsworthy RN73 Series <https://www.mouser.com/datasheet/2/418/4/NG_DS_1773270_M-604713.pdf> Vishay Dale D/CRCW e3 <https://www.mouser.com/datasheet/2/427/dcrcwe3-1762152.pdf> Ohmite B20 <https://www.ohmite.com/assets/docs/res_200.pdf?r=false>; DKPN: 311-100KHRTR-ND; MANUFACTURER: Yageo; MOPN: 603-RC0603FR-07100KL; MPN: RC0603FR-07100KL; POWER: 0.1W; RESISTANCE: 100k; TOLERANCE: 1%; VOLTAGE_CONTINUOUS: 75V; VOLTAGE_MAX: 75V
R36 = HyTechDevices:RESISTOR_?_*: Resistor PWR163 Series <https://www.mouser.com/datasheet/2/54/pwr163-777985.pdf> AC Series <https://www.mouser.com/datasheet/2/447/Yageo_PYu_AC_51_RoHS_L_7_1714230-1874691.pdf> PU Series <https://www.mouser.com/datasheet/2/447/PYu-PU_51_RoHS_L_6-1504619.pdf> UCR Series <https://fscdn.rohm.com/en/products/databook/datasheet/passive/resistor/chip_resistor/ucr-e.pdf> ERA Series <https://www.mouser.com/datasheet/2/315/AOA0000C307-1149632.pdf> PWR263 Series <https://www.mouser.com/datasheet/2/54/pwr263s_35-778069.pdf> KTR Series <https://www.mouser.com/datasheet/2/348/ROHM_S_A0011075115_1-2563276.pdf> RC Series <https://www.mouser.com/datasheet/2/447/Yageo_03_18_2021_PYu_RC_Group_51_RoHS_L_11-2199992.pdf> ERJ Low Resistance Series <https://www.mouser.com/datasheet/2/315/AOA0000C313-1141758.pdf> ERJ PB3, PB6 Series <https://www.mouser.com/datasheet/2/315/AOA0000C328-1530132.pdf> ERJ PA2, P03, PA3, P06, P08, P14 Series <https://www.mouser.com/datasheet/2/315/AOA0000C331-1141874.pdf> B20 Series <https://www.ohmite.com/assets/docs/res_200.pdf?r=false> TE Connectivity/Holsworthy RN73 Series <https://www.mouser.com/datasheet/2/418/4/NG_DS_1773270_M-604713.pdf> Vishay Dale D/CRCW e3 <https://www.mouser.com/datasheet/2/427/dcrcwe3-1762152.pdf> Ohmite B20 <https://www.ohmite.com/assets/docs/res_200.pdf?r=false>; DKPN: P22.1KDBCT-ND; MANUFACTURER: Panasonic Electronic Components; MOPN: 667-ERA-3AEB2212V; MPN: ERA-3AEB2212V; POWER: 0.1W; RESISTANCE: 22.1k; TOLERANCE: 0.1%; VOLTAGE_CONTINUOUS: 47.01V; VOLTAGE_MAX: 75V
R38-R43 = HyTechDevices:RESISTOR_?_*: Resistor PWR163 Series <https://www.mouser.com/datasheet/2/54/pwr163-777985.pdf> AC Series <https://www.mouser.com/datasheet/2/447/Yageo_PYu_AC_51_RoHS_L_7_1714230-1874691.pdf> PU Series <https://www.mouser.com/datasheet/2/447/PYu-PU_51_RoHS_L_6-1504619.pdf> UCR Series <https://fscdn.rohm.com/en/products/databook/datasheet/passive/resistor/chip_resistor/ucr-e.pdf> ERA Series <https://www.mouser.com/datasheet/2/315/AOA0000C307-1149632.pdf> PWR263 Series <https://www.mouser.com/datasheet/2/54/pwr263s_35-778069.pdf> KTR Series <https://www.mouser.com/datasheet/2/348/ROHM_S_A0011075115_1-2563276.pdf> RC Series <https://www.mouser.com/datasheet/2/447/Yageo_03_18_2021_PYu_RC_Group_51_RoHS_L_11-2199992.pdf> ERJ Low Resistance Series <https://www.mouser.com/datasheet/2/315/AOA0000C313-1141758.pdf> ERJ PB3, PB6 Series <https://www.mouser.com/datasheet/2/315/AOA0000C328-1530132.pdf> ERJ PA2, P03, PA3, P06, P08, P14 Series <https://www.mouser.com/datasheet/2/315/AOA0000C331-1141874.pdf> B20 Series <https://www.ohmite.com/assets/docs/res_200.pdf?r=false> TE Connectivity/Holsworthy RN73 Series <https://www.mouser.com/datasheet/2/418/4/NG_DS_1773270_M-604713.pdf> Vishay Dale D/CRCW e3 <https://www.mouser.com/datasheet/2/427/dcrcwe3-1762152.pdf> Ohmite B20 <https://www.ohmite.com/assets/docs/res_200.pdf?r=false>; DKPN: 2019-RK73H1JTTD4224FCT-ND; MANUFACTURER: KOA Speer Electronics, Inc.; MOPN: 660-RK73H1JTTD4224F; MPN: RK73H1JTTD4224F; POWER: 0.1W; RESISTANCE: 4.22M; TOLERANCE: 1%; VOLTAGE_CONTINUOUS: 75V; VOLTAGE_MAX: 100V
U1 = HyTechDevices:TPS54202DDCR; DKPN: 296-TPS54202DDCRCT-ND; MANUFACTURER: Texas-Instruments; MOPN: 595-TPS54202DDCR; MPN: TPS54202DDCR
U2 = HyTechDevices:MCP2551: MCP2551 Can Transciever Datasheet <https://www.mouser.com/datasheet/2/268/20001667G-1115479.pdf>; DKPN: MCP2551-I/SN-ND; MANUFACTURER: Microchip Technology; MOPN: 579-MCP2551-I/SN; MPN: MCP2551-I/SN
U6 = HyTechDevices:OPAMP_1_CHANNEL_*: Op-Amp 1 Channel OPA991 Datasheet <https://www.ti.com/lit/ds/symlink/opa991.pdf?ts=1615503614502> Note: OPA991 is also a comparator; DKPN: 296-OPA991IDCKRCT-ND; MANUFACTURER: Texas Instruments; MOPN: 595-OPA991IDCKR; MPN: OPA991IDCKR
U7 = HyTechDevices:MAX3075: 3.3 V RS-485/RS-422 Transceivers Datasheet <https://www.analog.com/media/en/technical-documentation/data-sheets/max3070e-max3079e.pdf>; DKPN: MAX3075EESA+-ND; MANUFACTURER: Analog Devices Inc.; MOPN: 700-MAX3075EESA; MPN: MAX3075EESA+
U8 = HyTechDevices:LTC1563*: Analog Devices LTC1563 Lowpass Filter. Datasheet <https://www.analog.com/media/en/technical-documentation/data-sheets/156323fa.pdf>; DKPN: LTC1563-2IGN-ND; MANUFACTURER: Analog Devices; MOPN: 584-LTC1563-2IGN; MPN: LTC1563-2IGN
U9 = HyTechDevices:OPAMP_2_CHANNEL_*: Op-Amp 2 Channel OPA2991 Datasheet <https://www.ti.com/lit/ds/symlink/opa2991.pdf?HQS=dis-mous-null-mousermode-dsf-pf-null-wwe&ts=1697521669896&ref_url=https%253A%252F%252Fwww.mouser.com%252F> Note: OPA2991 is also a comparator; DKPN: 296-OPA2991IDDFRCT-ND; MANUFACTURER: Texas Instruments; MOPN: 595-OPA2991IDDFR; MPN: OPA2991IDDFR
U10 = HyTechDevices:MCP2515: MCP2515 Can Controller Datasheet <https://www.mouser.com/datasheet/2/268/MCP2515-Stand-Alone-CAN-Controller-with-SPI-200018-708845.pdf>; DKPN: MCP2515-E/ST-ND; MANUFACTURER: Microchip Technology; MOPN: 579-MCP2515-E/ST; MPN: MCP2515-E/ST
X1 = HyTechDevices:CRYSTAL_*: Crystal Datasheet <https://www.mouser.com/datasheet/2/122/ECX_42-12562.pdf> Recommended load capacitor for the ECS-160-10-42-CKM-TR: VJ0603A150FXQPW1BC <https://www.mouser.com/datasheet/2/427/vjw1bcbascomseries-1762447.pdf>; DKPN: XC2566CT-ND; FREQUENCY: 16 MHz; LOAD_CAPACITANCE: 10pF; MANUFACTURER: TXC CORPORATION; MOPN: 520-160-10-42-CKMT; MPN: ECS-160-10-42-CKM-TR; SHUNT_CAPACITANCE: 2 - 5 pF
XF1 = HyTechDevices:FUSE_HOLDER_*: Fuse Holder All PNs for the holder; if Miniblade Fuses <https://www.littelfuse.com/media?resourcetype=datasheets&itemid=0f5f58cb-559e-494b-8d53-723f30445ae5&filename=littelfuse-mini-datasheet> needed, order separately. Mini-Blade PTH <https://www.mouser.com/datasheet/2/215/3568-742601.pdf> Mini-Blade SMD <https://www.mouser.com/datasheet/2/215/588-744913.pdf> Littelfuse 122 Fuse Holder and Fuse Fuse <https://www.littelfuse.com/~/media/electronics/datasheets/fuses/littelfuse_fuse_508_datasheet.pdf.pdf> Fuse Holder <https://www.littelfuse.com/~/media/electronics/datasheets/fuse_clips/littelfuse_fuse_clip_102_122_datasheet.pdf.pdf>; DKPN: 36-3568-ND; FUSE_TYPE: MINI 297; MANUFACTURER: Keystone; MOPN: 534-3568; MPN: 3568

## Board
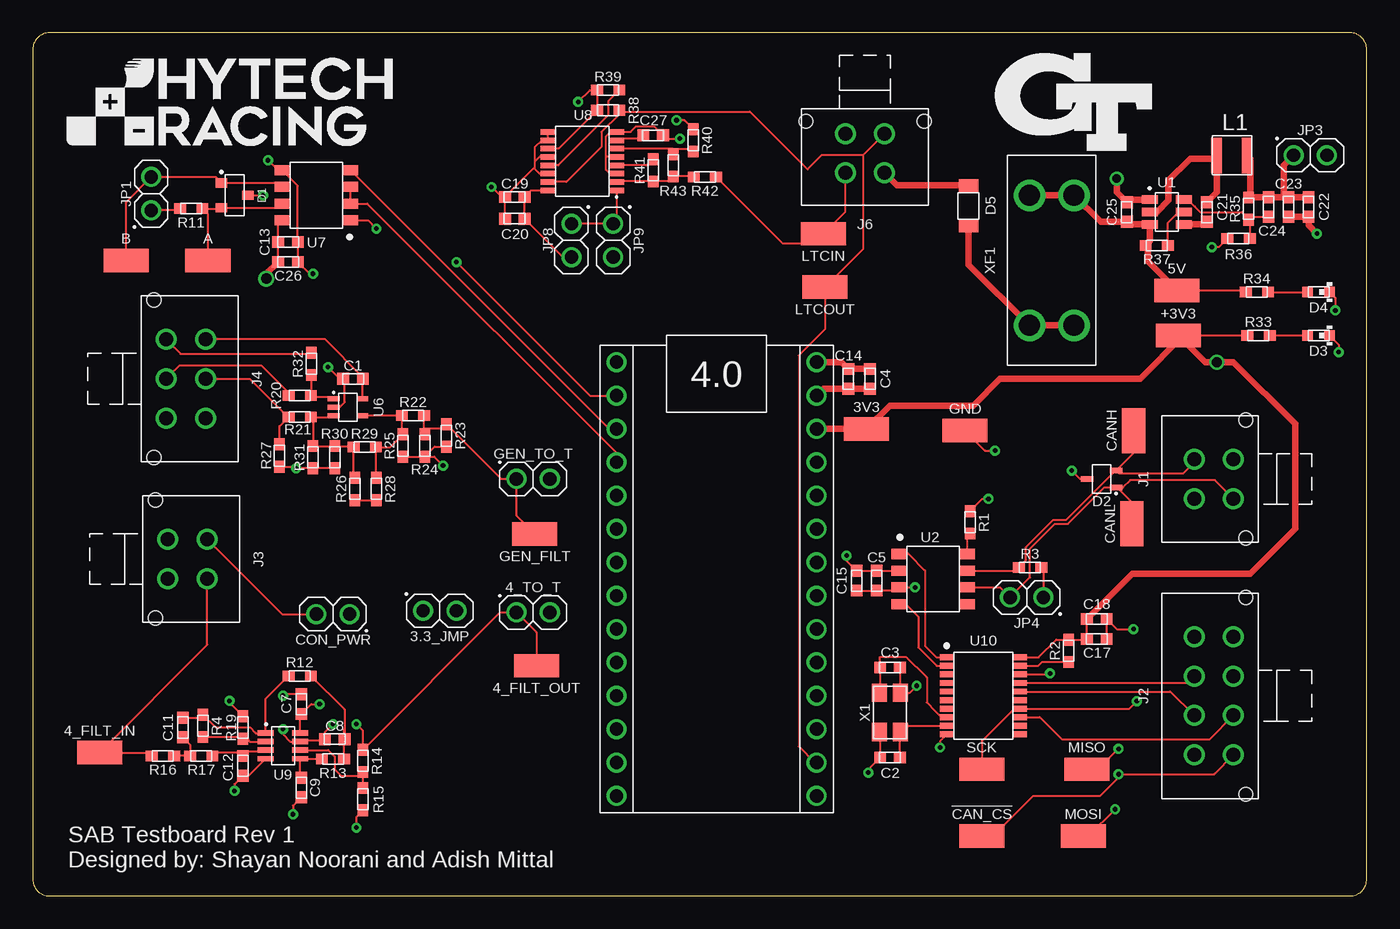
[diagram p2: board, top side]
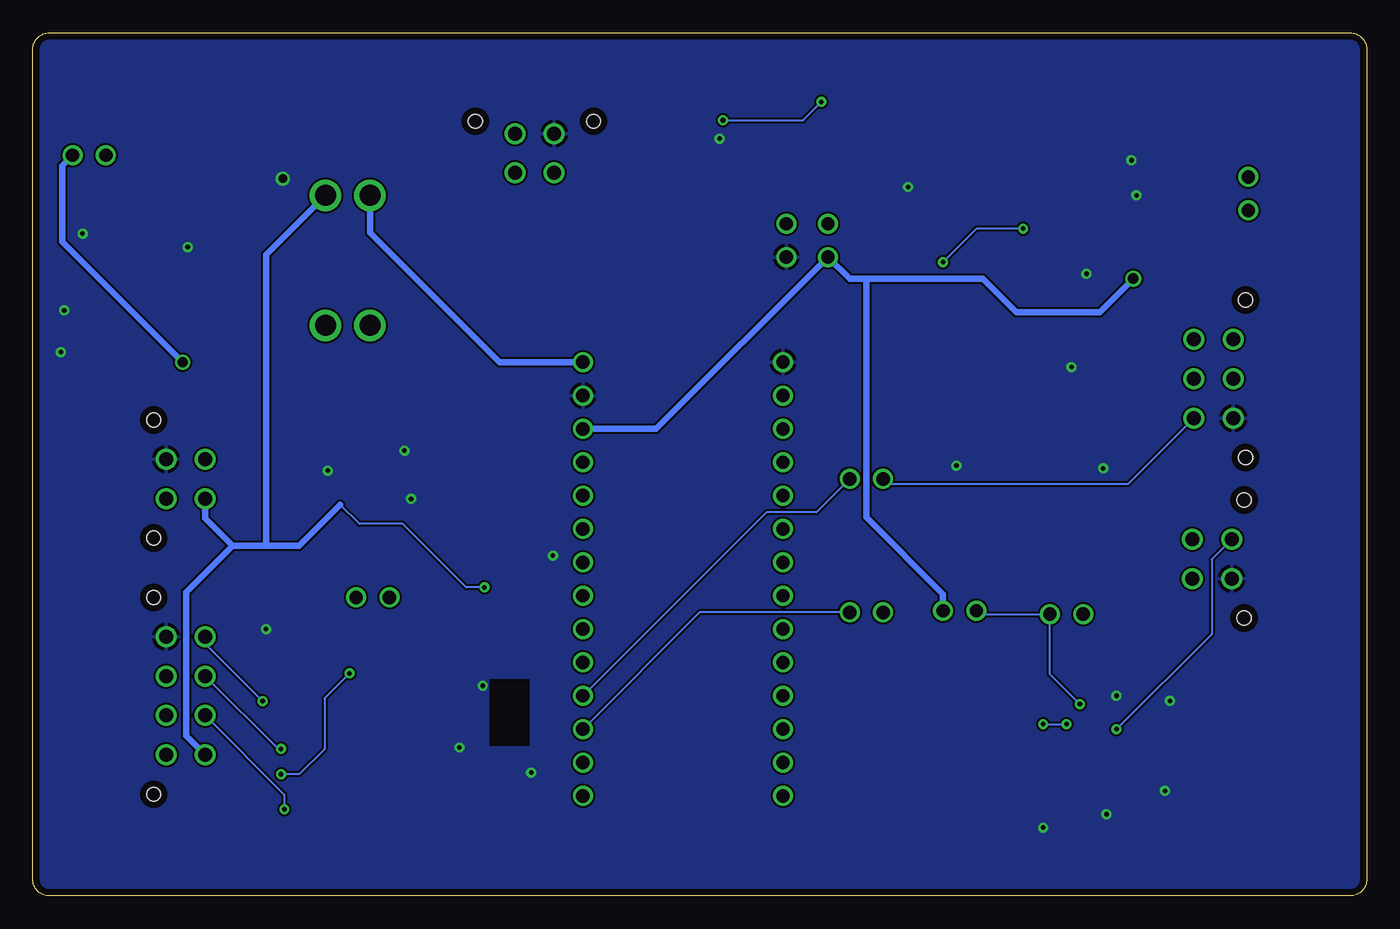
[diagram p3: board, bottom side, seen from below]

Size 101.58 x 65.71 mm. Coordinates in mm from the lower left corner, seen from the top.
Outline: 101.58,1.27 101.58,64.44 arc90 100.31,65.71 1.27,65.71 arc90 0,64.44 0,1.27 arc90 1.27,0 100.31,0 arc90 101.58,1.27
Copper layers (1*16): Top 0.035mm / dielectric 1.53mm / Bottom 0.035mm
Design rules "HyTech Default (2 Layer)": minimum track width 6mil, minimum drill 14mil, track to track 6mil, track to pad 6mil, pad to pad 6mil, via to via 20mil, smd to smd 6mil, copper to edge 20mil, drill to drill 21mil, minimum pad ring 7mil, minimum via ring 8mil, stop-mask expansion 6mil, vias tented up to drill 30mil, thermal gap 10mil

### Footprints (pad centres in the part's own frame; a part is rotated, then mirrored left to right if it is on the bottom)
1X02 = drill 1.016: 1 -1.27,0; 2 1.27,0
5015 = smd 3.429 x 1.778: 1 0,0
TEENSY_SHORT = drill 1.016: 3.3V 0,5.08; AGND/GND 0,2.54; D0 15.24,2.54; D1 15.24,5.08; D2 15.24,7.62; D3 15.24,10.16; D4 15.24,12.7; D5 15.24,15.24; D6 15.24,17.78; D7 15.24,20.32; D8 15.24,22.86; D9 15.24,25.4; D10 15.24,27.94; D11 15.24,30.48; D12 15.24,33.02; D13 0,33.02; D14 0,30.48; D15 0,27.94; D16 0,25.4; D17 0,22.86; D18 0,20.32; D19 0,17.78; D20 0,15.24; D21 0,12.7; D22 0,10.16; D23 0,7.62; GND 15.24,0; VIN 0,0
0603-CAP = smd 0.9 x 0.9: 1 -0.75,0; 2 0.75,0
SOT-23 = smd 0.711 x 0.889: 1 -0.94,-1.003; 2 0.94,-1.003; 3 0,1.003
SC-70-3 = smd 0.95 x 0.4: 1 -1.1,0.65; 2 -1.1,-0.65; 3 1.1,0
0603-LED = smd 0.8 x 0.8: 1 -0.825,0; 2 0.825,0
1206-DIODE = smd 1 x 1.5: 1 -1.497,0.019; 2 1.541,0.011
MOLEX_MICROFIT_PTH_VERTICAL_04_DUAL = drill 1.067: 1 1.499,-2.997; 2 -1.499,-2.997; 3 1.499,0; 4 -1.499,0 | hole 1.067: 4.496,0.94; -4.496,0.94
MOLEX_MICROFIT_PTH_VERTICAL_08_DUAL = drill 1.067: 1 4.496,-2.997; 2 1.499,-2.997; 3 -1.499,-2.997; 4 -4.496,-2.997; 5 4.496,0; 6 1.499,0; 7 -1.499,0; 8 -4.496,0 | hole 1.067: 7.493,0.94; -7.493,0.94
MOLEX_MICROFIT_PTH_VERTICAL_06_DUAL = drill 1.067: 1 2.997,-2.997; 2 0,-2.997; 3 -2.997,-2.997; 4 2.997,0; 5 0,0; 6 -2.997,0 | hole 1.067: 5.994,0.94; -5.994,0.94
PA4334 = smd 0.8 x 2.7: 1 -1.15,0; 2 1.15,0
0603-RES = smd 0.9 x 0.8: 1 -0.85,0; 2 0.85,0
SOT-23-6 = smd 0.62 x 1.22: 1 -0.95,-1.31; 2 0,-1.31; 3 0.95,-1.31; 4 -0.95,1.31; 5 0,1.31; 6 0.95,1.31
SOIC-08(NARROW,0.15") = smd 0.762 x 1.143: 1 -1.905,-2.603; 2 -0.635,-2.603; 3 0.635,-2.603; 4 1.905,-2.603; 5 1.905,2.603; 6 0.635,2.603; 7 -0.635,2.603; 8 -1.905,2.603
SC-70-5 = smd 0.4 x 0.9: 1 -0.65,-1.1; 2 0,-1.1; 3 0.65,-1.1; 4 0.65,1.1; 5 -0.65,1.1
SSOP-16 = smd 0.419 x 1.143: 1 -2.159,-2.54; 2 -1.524,-2.54; 3 -0.889,-2.54; 4 -0.254,-2.54; 5 0.381,-2.54; 6 1.016,-2.54; 7 1.651,-2.54; 8 2.286,-2.54; 9 2.286,2.667; 10 1.651,2.667; 11 1.016,2.667; 12 0.381,2.667; 13 -0.254,2.667; 14 -0.889,2.667; 15 -1.524,2.667; 16 -2.159,2.667
SOT-23-8 = smd 0.4 x 1.22: 1 -0.975,-1.31; 2 -0.325,-1.31; 3 0.325,-1.31; 4 0.975,-1.31; 5 0.975,1.31; 6 0.325,1.31; 7 -0.325,1.31; 8 -0.975,1.31
TSSOP-20 = smd 0.45 x 1.05: 1 -2.925,-2.775; 2 -2.275,-2.775; 3 -1.625,-2.775; 4 -0.975,-2.775; 5 -0.325,-2.775; 6 0.325,-2.775; 7 0.975,-2.775; 8 1.625,-2.775; 9 2.275,-2.775; 10 2.925,-2.775; 11 2.925,2.775; 12 2.275,2.775; 13 1.625,2.775; 14 0.975,2.775; 15 0.325,2.775; 16 -0.325,2.775; 17 -0.975,2.775; 18 -1.625,2.775; 19 -2.275,2.775; 20 -2.925,2.775
ECX-42 = smd 1.4 x 1.15: 1 -1.5,-0.8; 2 1.5,-0.8; 3 1.5,0.8; 4 -1.5,0.8
3568 = drill 1.6: 1 -4.953,1.702; 2 -4.953,-1.702; 3 4.953,-1.702; 4 4.953,1.702

### Placement (x,y rotation side)
3.3_JMP  30.99,21.72 0 top
3V3  63.5,35.56 0 top
4_FILT_IN  5.08,10.92 0 top
4_FILT_OUT  38.35,17.53 180 top
4_TO_T  38.1,21.59 0 top
5V  87.12,46.1 0 top
!CAN_CS  72.26,4.57 0 top
+3V3  87.25,42.67 0 top
A  13.34,48.39 0 top
A1  59.69,40.64 180 top
B  7.11,48.39 0 top
C1  24.38,39.37 180 top
C2  65.28,10.54 180 top
C3  65.28,17.4 0 top
C4  63.75,39.37 270 top
C5  64.26,24 90 top
C7  20.45,14.61 90 top
C8  22.99,11.94 0 top
C9  20.45,8.26 270 top
C11  11.43,12.83 270 top
C12  16,9.91 270 top
C13  19.43,49.78 0 top
C14  62.1,39.37 270 top
C15  62.74,24 90 top
C17  81.03,19.56 0 top
C18  81.03,21.08 0 top
C19  36.7,53.21 180 top
C20  36.7,51.56 180 top
C21  89.41,52.07 90 top
C22  97.16,52.45 270 top
C23  95.63,52.45 270 top
C24  94.11,52.45 270 top
C25  83.31,52.07 90 top
C26  19.43,48.26 0 top
C27  47.24,57.91 0 top
CANH  83.82,35.43 90 top
CANL  83.69,28.32 90 top
CON_PWR  22.86,21.46 180 top
D1  15.37,53.34 270 top
D2  81.41,31.75 180 top
D3  97.92,42.67 180 top
D4  97.92,45.97 180 top
D5  71.25,52.58 270 top
GEN_FILT  38.23,27.56 180 top
GEN_TO_T  38.1,31.75 0 top
GND  70.99,35.43 0 top
J1  91.44,31.75 270 top
J2  91.44,15.24 270 top
J3  10.29,25.65 90 top
J4  10.16,39.37 90 top
J6  63.37,58.04 0 top
JP1  9.02,53.47 90 top
JP3  97.28,56.39 0 top
JP4  75.69,22.73 180 top
JP8  41.02,49.91 270 top
JP9  44.2,49.91 270 top
L1  91.31,56.39 0 top
LTCIN  60.2,50.42 180 top
LTCOUT  60.33,46.35 180 top
MISO  80.26,9.65 0 top
MOSI  80.01,4.57 0 top
R1  71.37,28.45 270 top
R2  78.87,18.67 270 top
R3  75.95,25.02 0 top
R4  12.95,12.95 90 top
R11  12.06,52.32 180 top
R12  20.32,16.76 0 top
R13  22.86,10.41 180 top
R14  25.15,10.29 90 top
R15  25.15,7.37 90 top
R16  9.91,10.67 0 top
R17  12.83,10.67 0 top
R19  16,12.83 270 top
R20  20.32,38.1 0 top
R21  20.32,36.45 0 top
R22  28.96,36.58 0 top
R23  31.5,35.05 90 top
R24  29.84,34.29 90 top
R25  28.19,34.29 270 top
R26  24.51,30.99 270 top
R27  18.8,33.53 90 top
R28  26.16,30.99 90 top
R29  25.27,34.16 0 top
R30  22.99,33.4 90 top
R31  21.34,33.4 90 top
R32  21.21,40.51 90 top
R33  93.34,42.67 0 top
R34  93.22,45.97 0 top
R35  92.58,52.32 90 top
R36  91.82,50.04 0 top
R37  85.6,49.53 180 top
R38  43.81,59.82 180 top
R39  43.81,61.34 180 top
R40  50.29,57.53 270 top
R41  47.24,55.24 90 top
R42  51.18,54.74 180 top
R43  48.77,55.63 270 top
SCK  72.26,9.65 0 top
U1  86.36,52.07 270 top
U2  68.58,24.13 270 top
U6  24,37.21 270 top
U7  21.59,53.34 90 top
U8  41.91,55.88 90 top
U9  19.05,11.43 270 top
U10  72.39,15.24 270 top
U$1  [LOGO_HYTECH_MEDIUM]  2.54,57.15 0 top
U$3  [LOGO_GT_MEDIUM]  79.25,60.45 0 top
X1  65.28,13.97 90 top
XF1  77.6,48.39 90 top

### Tracks (layer width: path | path; a pad name or v marks a point on that pad's centre or on a via)
5VIN
  Top 0.508: D5.1 71.22,54.12 65.79,54.12 J6.1
!CAN_CS  (via drill 0.35)
  Top 0.152: !CAN_CS.1 73.15,4.57 76.2,7.62 81.28,7.62 82.68,9.02 v82.68,9.27 89.97,9.27 J2.5 | U10.18 77.39,16.86 v77.47,16.95
  Bottom 0.152: v77.47,16.95 79.38,15.04 79.38,11.18 81.28,9.27 v82.68,9.27
!CAN_INT
  Top 0.152: U10.13 76.68,13.62 78.36,11.94 89.64,11.94 J2.6
+3V3  (via drill 0.75, 0.8)
  Top 0.152: U8.16 37.96,53.72 C19.1 C20.1 40.37,48.64 JP8.2 | C26.1 C13.1 18.68,51.13 U7.8 | +3V3.1 87.63,42.67 R33.1 | C18.1 C17.1 80.24,19.52 R2.1 77.94,19.52 76.58,18.16 U10.20
  Top 0.508: +3V3.1 89.28,40.64 v90.17,40.64 91.44,40.64 96.14,35.94 96.14,27.96 92.71,24.54 83.73,24.54 C18.1 | 87.63,42.67 84.33,39.37 73.66,39.37 71.63,37.34 65.28,37.34 3V3.1 A1.3.3V | v17.78,46.99 17.78,47.36 C26.1
  Bottom 0.508: JP3.2 99.34,55.6 99.34,49.81 v90.17,40.64 | A1.3.3V 54.1,35.56 JP8.2 39.37,46.99 38.1,46.99 | 3.3_JMP.2 32.26,22.99 38.1,28.83 38.1,46.99 | 38.1,46.99 29.21,46.99 26.67,44.45 20.32,44.45 v17.78,46.99
+5V  (via drill 0.35)
  Top 0.152: C25.1 83.51,51.12 | R37.2 84.92,49.7 85.05,49.83 | C15.1 C5.1 64.62,23.25 64.63,23.24 65.72,23.24 U2.3 v67.18,23.5 | 5V.1 92.24,46.1 R34.1
  Top 0.508: 83.51,51.12 U1.3 85.05,49.83 | XF1.4 XF1.3 81.32,51.32 C25.1 | A1.VIN 61.58,40.64 C14.1 C4.1 | 5V.1 84.92,48.3 84.92,49.7
  Bottom 0.152: v67.18,23.5 68.58,23.5 73.41,28.32 76.71,28.32 78.17,29.78
  Bottom 0.508: XF1.3 83.82,48.82 83.82,26.67 | 78.17,29.78 81.28,26.67 83.82,26.67 | 83.82,26.67 86.36,26.67 | 86.36,26.67 88.44,28.75 J1.1 | J2.1 89.92,12.22 89.92,23.11 86.36,26.67 | A1.VIN 66.04,40.64 75.89,50.49 XF1.4
A
  Top 0.152: U7.7 18.68,52.4 D1.2 14.29,52.32 R11.1 13.34,51.9 A.1
B
  Top 0.152: U7.6 18.68,54.28 D1.1 13.91,54.74 JP1.2 7.11,52.83 B.1
CANH
  Top 0.152: U2.7 74.84,24.77 R3.1 75.64,25.56 75.64,26.54 77.72,28.63 78.7,28.63 82.48,32.4 D2.2 | D2.2 82.76,32.15 87.59,32.15 88.44,32.99 J1.2 | D2.2 83.47,33.37 83.82,33.71 83.82,34.29 CANH.1
CANL
  Top 0.152: U2.6 73.66,23.5 JP4.2 75.95,24.26 75.95,26.42 77.85,28.32 78.83,28.32 81.61,31.1 D2.1 82.55,31.1 | 82.55,31.1 83.02,31.1 83.58,31.66 90.03,31.66 J1.3 | CANL.1 83.69,29.96 82.55,31.1
DE/RE
  Top 0.152: U7.3 U7.2 25.46,52.7 25.87,52.3 25.88,52.3 44.45,33.72 A1.D2
EN
  Top 0.152: R37.1 86.45,51.27 87.25,52.07 U1.5
FOURTH_ORDER_FILT
  Bottom 0.152: 4_TO_T.2 50.8,21.59 A1.D15
GEN_FILT_TEENSY
  Bottom 0.152: GEN_TO_T.2 41.91,29.21 45.72,29.21 A1.D16
GND  (via drill 0.35, 0.65)
  Top 0.152: C25.2 83.51,53.02 | U6.2 23.37,37.21 23.75,37.59 23.75,39.26 C1.2 23.37,39.37 v22.48,40.26 | U2.2 65.97,24.75 C5.2 C15.2 61.98,25.52 v61.98,25.91 | v49.28,57.66 48.25,57.66 C27.2 47.31,58.59 45.95,58.59 45.52,58.17 U8.8 43.98,58.17 43.65,57.84 43.65,56.26 | U8.3 43.94,54.99 43.65,55.28 43.65,56.26 | U8.5 43.65,56.26 | U8.9 U8.10 39.19,57.59 38.83,57.59 38.23,56.98 38.23,55.88 | U8.12 38.61,56.26 38.23,55.88 | 38.23,55.88 38.23,55.49 | 38.23,55.49 38.23,55.37 38.61,54.99 U8.14 | C20.2 C19.2 | C19.2 38.23,55.49 | X1.4 64.53,12.42 C2.2 63.63,9.64 v63.63,9.4 | C3.2 66.08,17.35 X1.2 66.78,15.47 v67.31,16 | C7.2 19.16,15.36 v19.05,15.24 | R19.1 14.99,14.69 v14.99,14.86 | v15.37,8 15.37,8.52 C12.2 16.44,9.16 U9.4 | C9.2 19.81,6.87 v19.81,6.22 | R15.1 24.64,6.01 v24.64,5.21 | R30.1 R31.1 v20.07,32.55 19.94,32.68 R27.1 | R25.2 R24.1 | R24.1 30.61,34.2 R23.1 | R24.1 30.57,33.44 v31.24,32.77 | D3.1 99.44,41.97 v99.44,41.4 | D4.1 99.22,45.5 99.19,45.47 v99.19,44.58 | R36.1 90.34,49.4 v89.79,49.4 | v21.34,47.37 21.07,47.37 C26.2 C13.2 20.18,54.06 19.65,54.59 U7.5 18.67,55.24 v17.91,56.01 | D1.3 v17.53,53.34 | C19.2 35.69,53.21 v34.92,53.98 | C17.2 C18.2 82.54,20.32 v83.82,20.32 | U10.10 69.09,11.79 v69.09,11.3 | D2.3 79.76,31.75 v79.12,32.38 | R1.1 72.3,30.23 v72.77,30.23 | GND.1 72.52,33.91 v73.28,33.91
  Top 0.508: 83.51,53.02 U1.1 | A1.AGND/GND 60.21,38.62 C14.2 C4.2 | v97.79,50.42 97.16,51.05 C22.2 C23.2 | C25.2 82.55,53.58 v82.55,54.61
  pour Bottom: -1.27,67.31 -1.27,-1.27 0,-2.54 104.14,-2.54 104.14,67.31
LPAIN
  Top 0.152: 48.73,56.9 U8.6 | 48.73,56.9 50.08,56.9 R40.2 | R43.1 48.73,56.52 48.73,56.9
LTCIN
  Top 0.152: R42.1 57.11,49.66 59.44,49.66 LTCIN.1 61.87,52.09 J6.2
LTCOUT
  Top 0.152: U8.15 40.64,54.36 43.31,57.02 43.31,58.17 44.66,59.52 R38.1 44.77,59.72 54.6,59.72 59,55.31 60.1,56.41 63.25,56.41 | A1.D14 59.56,10.16 58.33,11.39 58.33,41.15 60.33,43.14 LTCOUT.1 63.25,49.28 63.25,56.41 | 63.25,56.41 J6.3
MISO  (via drill 0.35)
  Top 0.152: U10.17 87.92,16.21 J2.3 | v82.68,11.2 81.12,9.65 MISO.1
  Bottom 0.152: J2.3 82.79,11.09 v82.68,11.2
MOSI  (via drill 0.35)
  Top 0.152: U10.16 86.62,15.56 J2.2 | v82.42,6.6 80.39,4.57 MOSI.1
  Bottom 0.152: J2.2 82.42,7.72 v82.42,6.6
N$1
  Top 0.152: C2.1 66.03,12.42 X1.1 66.57,12.96 U10.9
N$2
  Top 0.152: X1.3 64.53,15.52 C3.1 64.53,18.2 66.51,18.2 68.07,16.64 68.07,14.73 68.71,14.1 69.19,13.62 U10.8
N$3
  Top 0.152: U2.8 71.18,27.41 R1.2
N$4
  Top 0.152: R3.2 76.96,24.85 JP4.1
N$5
  Top 0.152: U10.19 76.57,17.52 76.87,17.82 R2.2
N$6
  Top 0.508: XF1.2 XF1.1 71.26,48.07 D5.2
N$7
  Top 0.152: R11.2 11.09,52.2 JP1.1
N$8
  Top 0.152: R13.2 21.97,10.46 U9.5 20.36,9.09 C9.1
N$9
  Top 0.152: R28.2 26.16,34.12 R29.2 27.22,34.16 R25.1 28.11,35.23 R22.1 25.12,36.58 U6.4
N$10
  Top 0.152: U8.1 44.45,51.44 JP9.1 JP8.1
N$11
  Top 0.152: R12.2 23.74,14.2 23.74,12.7 | 23.74,12.7 C8.2 | R13.1 23.71,12.67 23.74,12.7
N$12
  Top 0.152: R32.1 21.21,38.14 R20.2 21.3,37.97 22.79,37.97 U6.1
N$13
  Top 0.152: R15.2 25.15,9.14 | 25.15,9.14 R14.1 | U9.6 22.49,11.11 22.99,10.61 22.99,9.65 23.5,9.14 25.15,9.14
N$18
  Top 0.152: 89.21,51.12 C21.1
  Top 0.508: U1.6 89.21,51.12
N$19
  Top 0.152: U9.3 17.61,10.98 16.32,10.98 C12.1 15.74,10.92 13.93,10.92 R17.2
N$20
  Top 0.152: R16.2 R17.1 11.98,11.53 C11.2
N$21
  Top 0.152: R12.1 17.74,15.03 U9.1 16.98,12.4 16.56,12.83 13.93,12.83 R4.2 12.73,13.58 C11.1
N$22
  Top 0.152: U9.2 16.53,11.76 16.3,11.98 R19.2 15.88,12.1 R4.1
N$23
  Top 0.152: R33.2 D3.2
N$25
  Top 0.152: R34.2 D4.2
N$27
  Top 0.152: R26.2 R28.1
N$28
  Top 0.152: U6.3 22.79,36.45 R21.2 21.34,36.28 R31.2 R30.2 24.34,34.25 R29.1 24.42,31.93 R26.1
N$29
  Top 0.152: U8.7 44.58,57.66 46.11,57.66 46.37,57.91 C27.1
N$30
  Top 0.152: U1.4 87.96,53.02 88.51,52.48 88.51,52.46 88.9,52.07 92.08,52.07 92.58,51.56 R35.1 | R35.1 92.67,51.39 R36.2 | R35.1 92.81,51.7 C24.2
N$32
  Top 0.152: R39.1 43.81,60.49 43.81,59.44 40.01,55.63 U8.13
N$33  (via drill 0.35)
  Top 0.152: U8.11 40.04,56.9 R38.2 R39.2 42.42,61.34 v41.53,60.45 | R40.1 49.62,59.05 v49.02,59.05
  Bottom 0.152: v49.02,59.05 42.93,59.05 v41.53,60.45
N$34
  Top 0.152: R41.2 47.2,56.09 46.74,55.63 U8.4
N$35
  Top 0.152: R42.2 50.29,54.78 R43.2 48.39,54.4 R41.1 44.49,54.4 U8.2
N$41
  Top 0.508: 92.71,53.2 92.61,53.2 R35.2 | 95.25,53.2 C24.1 92.71,53.2 | 95.25,53.2 C23.1 C22.1 | L1.2 92.71,56.14 92.71,53.2 | JP3.1 95.25,55.63 95.25,53.2
N$42  (via drill 0.35)
  Top 0.152: U9.8 20.36,13.77 C7.1 21.2,14.61 v21.84,14.61
  Bottom 0.152: v21.84,14.61 24.13,16.89 CON_PWR.1 29.46,21.46 3.3_JMP.1
P2
  Top 0.152: R27.2 18.8,35.77 19.45,36.43 | 19.45,36.43 R21.1 | J4.2 16.51,39.37 19.45,36.43
P3
  Top 0.152: R24.2 29.81,35.18 29.81,35.56 | 29.81,35.56 R22.2 | 29.81,35.56 31.15,35.56 R23.2 35.65,31.75 GEN_TO_T.1 36.83,28.96 GEN_FILT.1
  Bottom 0.152: GEN_TO_T.1 36.45,31.37 18.16,31.37 J4.3
P4
  Top 0.152: J4.4 11.25,41.27 21.12,41.27 R32.2
P5
  Top 0.152: J4.5 11.19,40.4 13.58,40.4 13.6,40.39 17.4,40.39 19.47,38.31 R20.1
P7
  Top 0.152: CON_PWR.2 18.97,21.46 J3.1
P8
  Top 0.152: J3.2 13.28,19.13 4_FILT_IN.1 8.8,10.92 R16.1
P9  (via drill 0.35)
  Top 0.152: v24.64,13.08 25.15,12.57 R14.2 35.6,21.59 4_TO_T.1 38.35,20.07 4_FILT_OUT.1 | v22.86,13.08 22.24,12.46 C8.1 22.11,11.81 20.42,11.81 U9.7 19.61,11.76 19.05,12.32 v19.05,12.7
  Bottom 0.152: v24.64,13.08 v22.86,13.08 | J3.3 11.81,25.63 11.81,19.94 v19.05,12.7
RX_485  (via drill 0.35)
  Top 0.152: U7.1 25.53,51.44 v26.16,50.8 | v32.26,48.26 42.42,38.1 A1.D0
  Bottom 0.152: v26.16,50.8 29.72,50.8 v32.26,48.26
RXCAN
  Top 0.152: U2.4 66.23,22.48 67.44,21.27 67.44,18.92 68.84,17.52 U10.2
SCK  (via drill 0.35)
  Top 0.152: SCK.1 72.26,11.79 74.67,14.2 75.1,14.2 U10.14 83.51,14.27 v84.07,14.83
  Bottom 0.152: v84.07,14.83 88.44,19.2 J2.4
SW
  Top 0.152: 90.16,56.13 L1.1
  Top 0.508: U1.2 85.6,52.07 86.49,52.96 86.49,54.48 88.14,56.13 90.16,56.13 90.16,53.58 C21.2
TX_485
  Top 0.152: U7.4 24.85,54.59 24.86,54.59 43.88,35.56 A1.D1
TXCAN
  Top 0.152: U10.1 68.83,18.16 67.94,19.05 67.94,24.77 66.67,26.04 U2.1
VIN
  Top 0.152: U6.5 25.13,37.89 C1.1 25.13,39.51 22.28,42.37 J4.1

### Text on the board
tPlace: SAB Testboard Rev 1 / Designed by: Shayan Noorani and Adish Mittal